# EasyEDA Pro project RinaBoard_V1_0.eprj, board PCB1
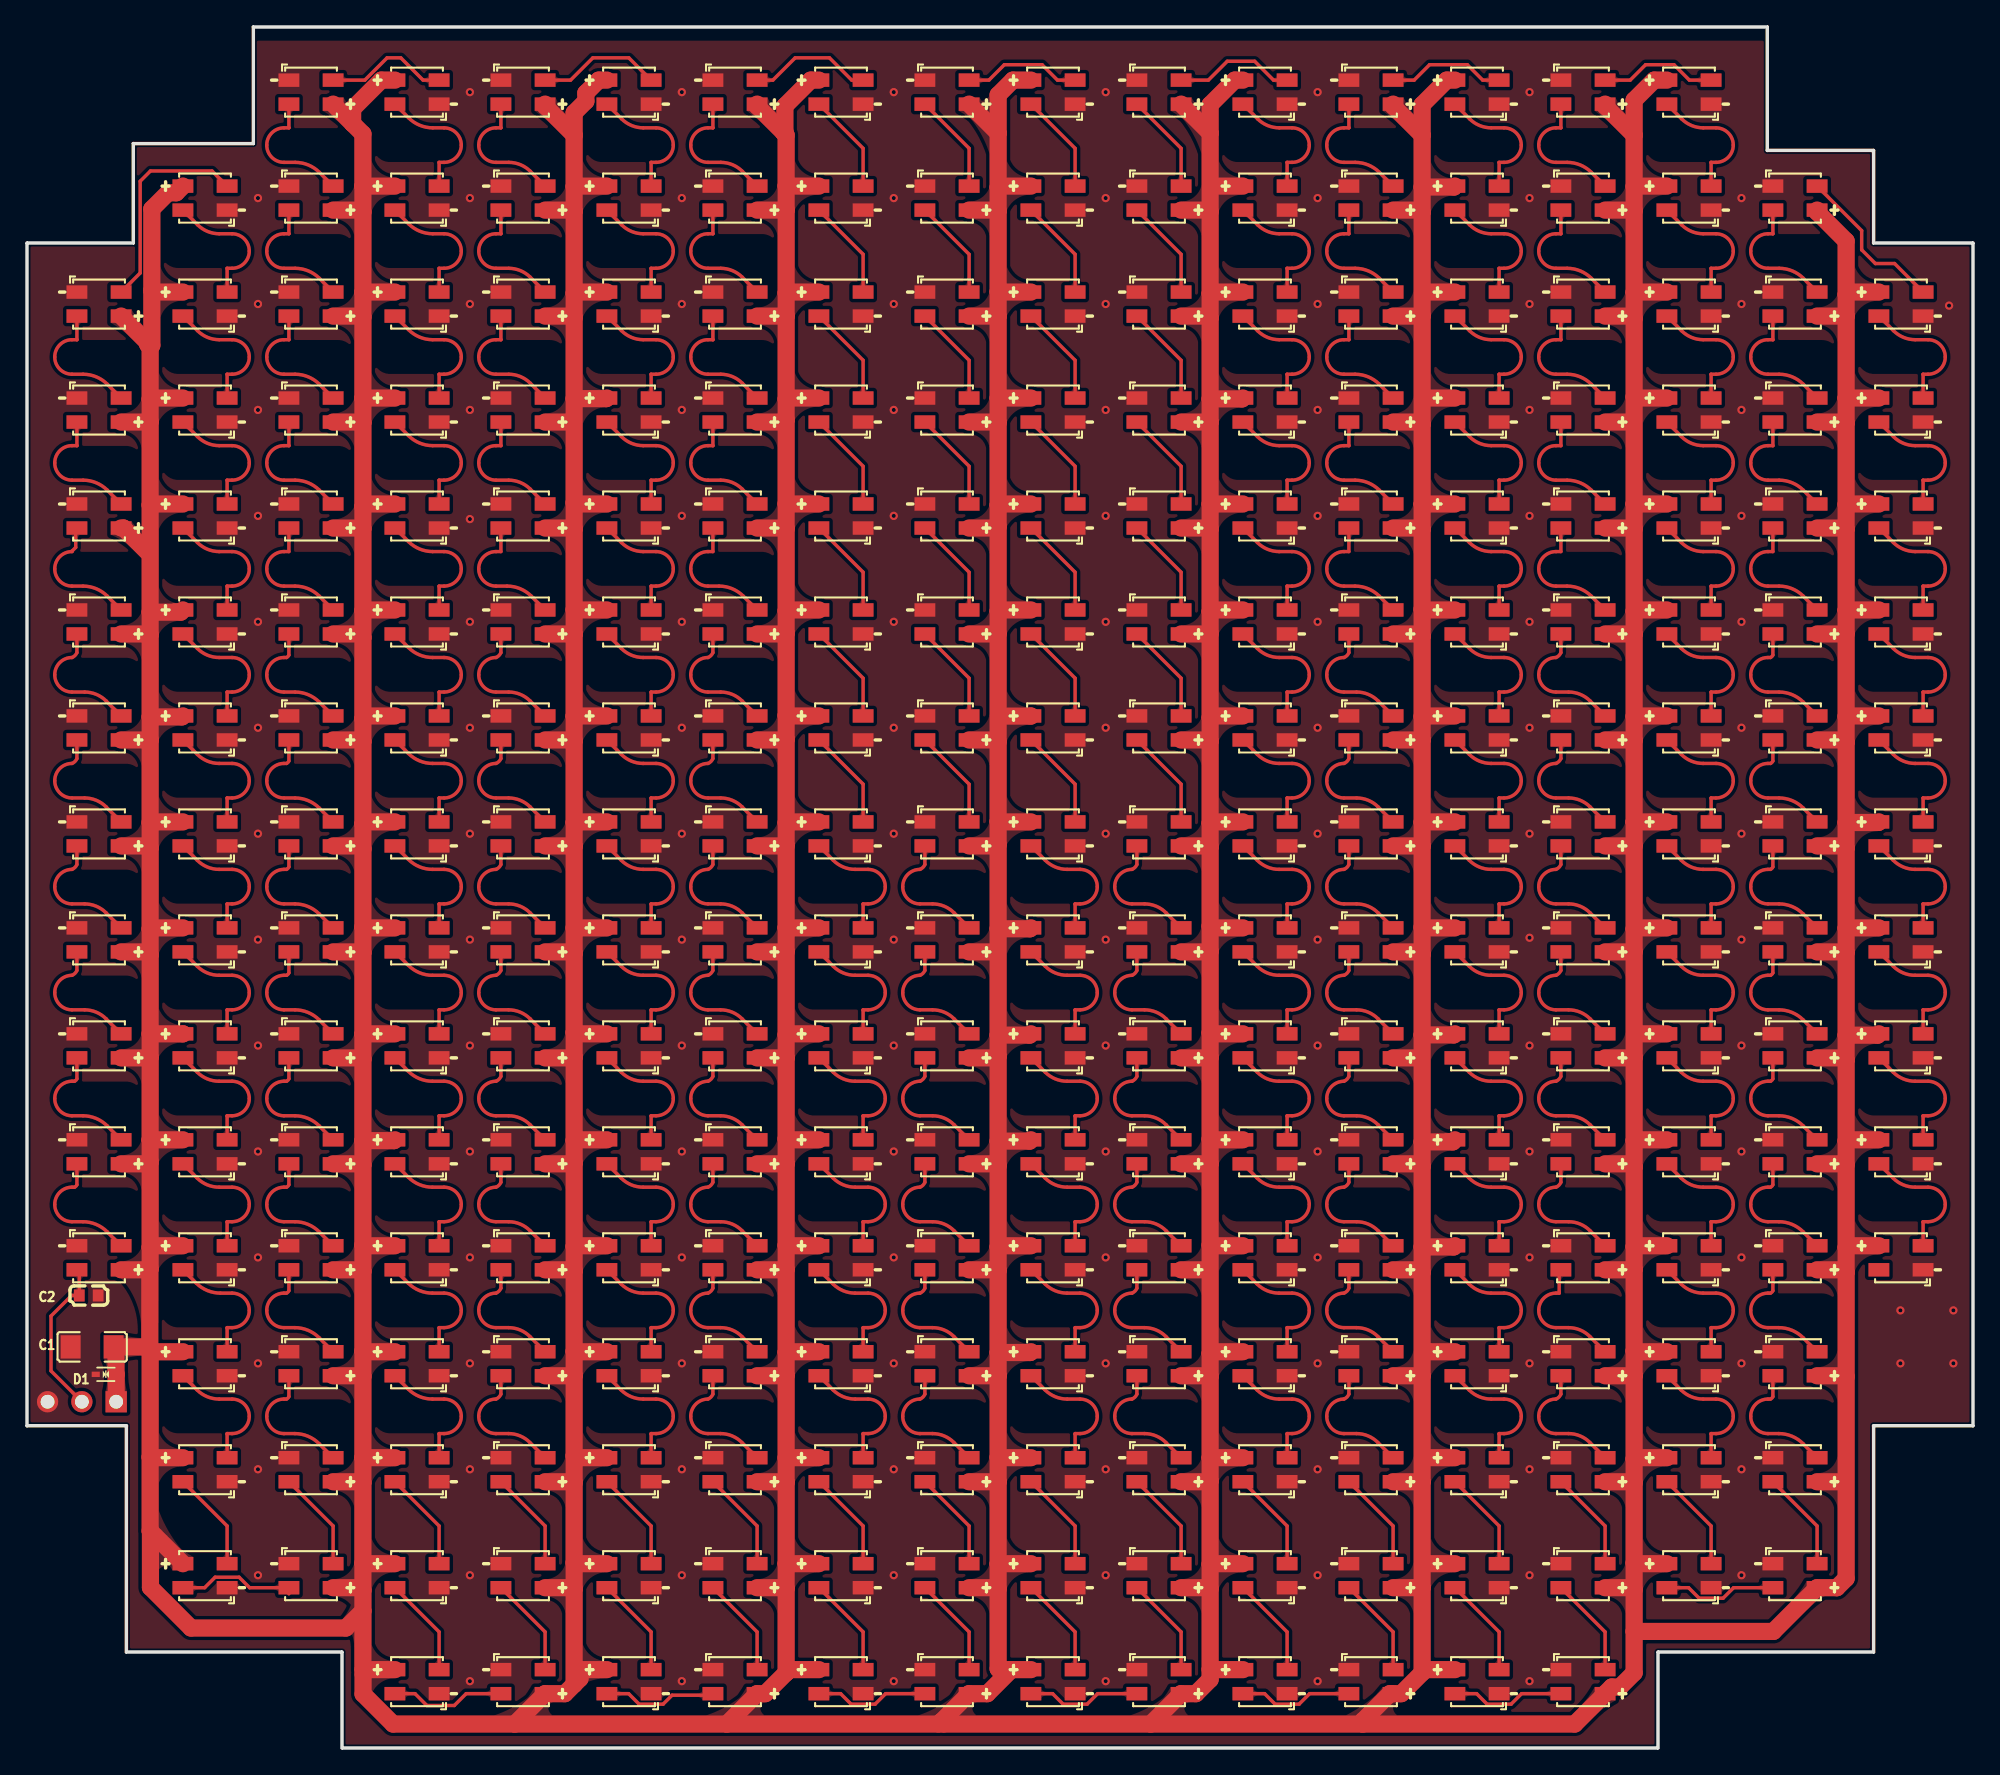
[diagram p5: board, top side]
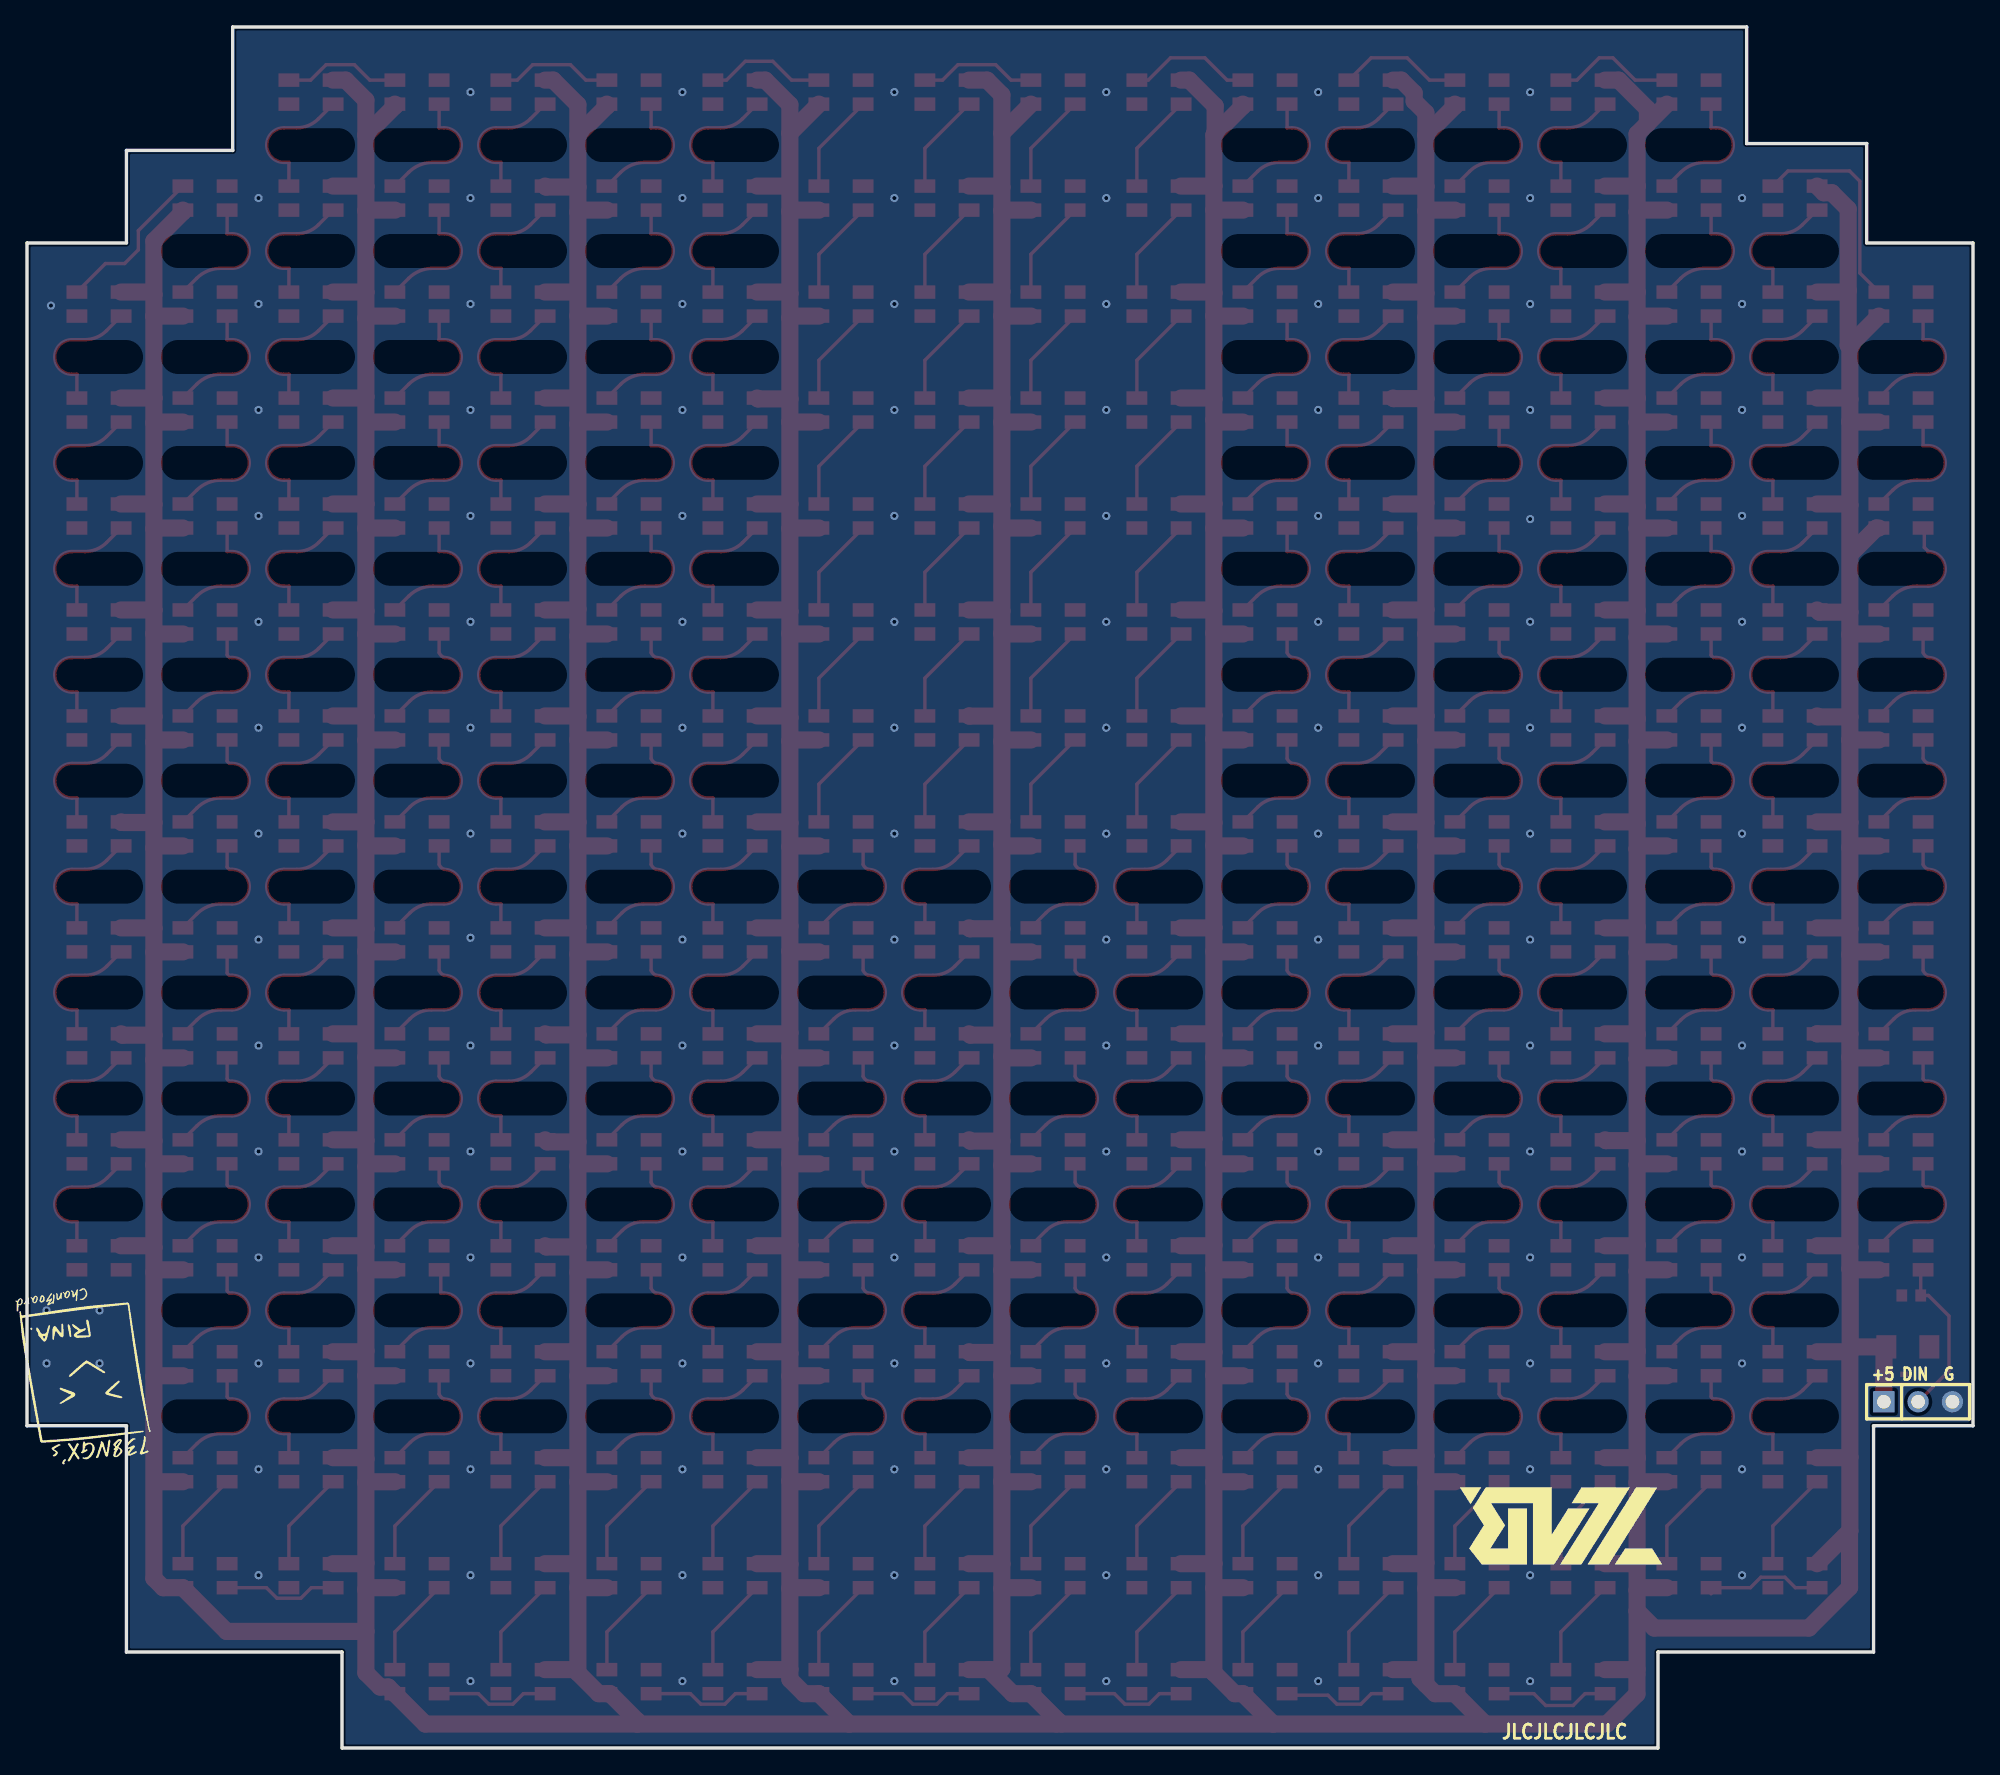
[diagram p6: board, bottom side, seen from below]

Outline 144.14 x 127.51 mm; copper layers: Top Layer, Bottom Layer. Coordinates in mm from the lower left corner of the outline.
Outline path: 0,111.51 0,23.88 7.37,23.88 7.37,7.11 23.33,7.11 23.33,0 120.8,0 120.8,7.11 136.77,7.11 136.77,23.88 144.14,23.88 144.14,111.51 136.77,111.51 136.77,118.36 128.9,118.36 128.9,127.51 16.76,127.51 16.76,118.87 7.87,118.87 7.87,111.51 0,111.51
Stack: Top Layer 0.035mm / Dielectric1 1.51mm FR4 er 4.5 / Bottom Layer 0.035mm

## Design rules (mm)
template: 自定义配置
spacing copperThickness1oz (default): track to track 0.102, other pairs 0.152 to 0.3
spacing copperThickness2oz: track to track 0.203, other pairs 0.152 to 0.3
track width copperThickness1oz (default): min 0.127, default 0.254, max 2.54
track width copperThickness2oz: min 0.203, default 0.254, max 2.54
differential pair differentialPair (default): width min 0.127, default 0.254, max 2.54; gap min 0.152, default 0.152
via viaSize (default): diameter min 0.5, default 0.61, max 10; hole min 0.3, default 0.305, max 6.3
pour e16117 uses copperRegion

## Placement (name value [footprint] x y rotation side)
C1  47uF  [C1206]  4.83 29.72 0 top
C2  100nF  [C0603]  4.57 33.53 180 top
D1  ESD5B5.0ST1G-N  [SOD-523_L1.2-W0.8-LS1.6-BI]  5.84 27.69 180 top
H1  -  [HDR-TH_3P-P2.54-V-F]  4.06 25.65 180 bottom
LED0  WS2812B-MINI-V3/W  [LED-SMD_4P-L3.5-W3.5-TL_WS2812B]  5.33 36.32 180 top
LED1  WS2812B-MINI-V3/W  [LED-SMD_4P-L3.5-W3.5-TL_WS2812B]  5.33 44.17 180 top
LED2  WS2812B-MINI-V3/W  [LED-SMD_4P-L3.5-W3.5-TL_WS2812B]  5.33 52.02 180 top
LED3  WS2812B-MINI-V3/W  [LED-SMD_4P-L3.5-W3.5-TL_WS2812B]  5.33 59.87 180 top
LED4  WS2812B-MINI-V3/W  [LED-SMD_4P-L3.5-W3.5-TL_WS2812B]  5.33 67.72 180 top
LED5  WS2812B-MINI-V3/W  [LED-SMD_4P-L3.5-W3.5-TL_WS2812B]  5.33 75.57 180 top
LED6  WS2812B-MINI-V3/W  [LED-SMD_4P-L3.5-W3.5-TL_WS2812B]  5.33 83.43 180 top
LED7  WS2812B-MINI-V3/W  [LED-SMD_4P-L3.5-W3.5-TL_WS2812B]  5.33 91.28 180 top
LED8  WS2812B-MINI-V3/W  [LED-SMD_4P-L3.5-W3.5-TL_WS2812B]  5.33 99.13 180 top
LED9  WS2812B-MINI-V3/W  [LED-SMD_4P-L3.5-W3.5-TL_WS2812B]  5.33 106.98 180 top
LED10  WS2812B-MINI-V3/W  [LED-SMD_4P-L3.5-W3.5-TL_WS2812B]  13.19 114.83 0 top
LED11  WS2812B-MINI-V3/W  [LED-SMD_4P-L3.5-W3.5-TL_WS2812B]  13.19 106.98 0 top
LED12  WS2812B-MINI-V3/W  [LED-SMD_4P-L3.5-W3.5-TL_WS2812B]  13.19 99.13 0 top
LED13  WS2812B-MINI-V3/W  [LED-SMD_4P-L3.5-W3.5-TL_WS2812B]  13.19 91.28 0 top
LED14  WS2812B-MINI-V3/W  [LED-SMD_4P-L3.5-W3.5-TL_WS2812B]  13.19 83.43 0 top
LED15  WS2812B-MINI-V3/W  [LED-SMD_4P-L3.5-W3.5-TL_WS2812B]  13.19 75.57 0 top
LED16  WS2812B-MINI-V3/W  [LED-SMD_4P-L3.5-W3.5-TL_WS2812B]  13.19 67.72 0 top
LED17  WS2812B-MINI-V3/W  [LED-SMD_4P-L3.5-W3.5-TL_WS2812B]  13.19 59.87 0 top
LED18  WS2812B-MINI-V3/W  [LED-SMD_4P-L3.5-W3.5-TL_WS2812B]  13.19 52.02 0 top
LED19  WS2812B-MINI-V3/W  [LED-SMD_4P-L3.5-W3.5-TL_WS2812B]  13.19 44.17 0 top
LED20  WS2812B-MINI-V3/W  [LED-SMD_4P-L3.5-W3.5-TL_WS2812B]  13.19 36.32 0 top
LED21  WS2812B-MINI-V3/W  [LED-SMD_4P-L3.5-W3.5-TL_WS2812B]  13.19 28.47 0 top
LED22  WS2812B-MINI-V3/W  [LED-SMD_4P-L3.5-W3.5-TL_WS2812B]  13.19 20.62 0 top
LED23  WS2812B-MINI-V3/W  [LED-SMD_4P-L3.5-W3.5-TL_WS2812B]  13.19 12.77 0 top
LED24  WS2812B-MINI-V3/W  [LED-SMD_4P-L3.5-W3.5-TL_WS2812B]  21.04 12.77 180 top
LED25  WS2812B-MINI-V3/W  [LED-SMD_4P-L3.5-W3.5-TL_WS2812B]  21.04 20.62 180 top
LED26  WS2812B-MINI-V3/W  [LED-SMD_4P-L3.5-W3.5-TL_WS2812B]  21.04 28.47 180 top
LED27  WS2812B-MINI-V3/W  [LED-SMD_4P-L3.5-W3.5-TL_WS2812B]  21.04 36.32 180 top
LED28  WS2812B-MINI-V3/W  [LED-SMD_4P-L3.5-W3.5-TL_WS2812B]  21.04 44.17 180 top
LED29  WS2812B-MINI-V3/W  [LED-SMD_4P-L3.5-W3.5-TL_WS2812B]  21.04 52.02 180 top
LED30  WS2812B-MINI-V3/W  [LED-SMD_4P-L3.5-W3.5-TL_WS2812B]  21.04 59.87 180 top
LED31  WS2812B-MINI-V3/W  [LED-SMD_4P-L3.5-W3.5-TL_WS2812B]  21.04 67.72 180 top
LED32  WS2812B-MINI-V3/W  [LED-SMD_4P-L3.5-W3.5-TL_WS2812B]  21.04 75.57 180 top
LED33  WS2812B-MINI-V3/W  [LED-SMD_4P-L3.5-W3.5-TL_WS2812B]  21.04 83.43 180 top
LED34  WS2812B-MINI-V3/W  [LED-SMD_4P-L3.5-W3.5-TL_WS2812B]  21.04 91.28 180 top
LED35  WS2812B-MINI-V3/W  [LED-SMD_4P-L3.5-W3.5-TL_WS2812B]  21.04 99.13 180 top
LED36  WS2812B-MINI-V3/W  [LED-SMD_4P-L3.5-W3.5-TL_WS2812B]  21.04 106.98 180 top
LED37  WS2812B-MINI-V3/W  [LED-SMD_4P-L3.5-W3.5-TL_WS2812B]  21.04 114.83 180 top
LED38  WS2812B-MINI-V3/W  [LED-SMD_4P-L3.5-W3.5-TL_WS2812B]  21.04 122.68 180 top
LED39  WS2812B-MINI-V3/W  [LED-SMD_4P-L3.5-W3.5-TL_WS2812B]  28.89 122.68 0 top
LED40  WS2812B-MINI-V3/W  [LED-SMD_4P-L3.5-W3.5-TL_WS2812B]  28.89 114.83 0 top
LED41  WS2812B-MINI-V3/W  [LED-SMD_4P-L3.5-W3.5-TL_WS2812B]  28.89 106.98 0 top
LED42  WS2812B-MINI-V3/W  [LED-SMD_4P-L3.5-W3.5-TL_WS2812B]  28.89 99.13 0 top
LED43  WS2812B-MINI-V3/W  [LED-SMD_4P-L3.5-W3.5-TL_WS2812B]  28.89 91.28 0 top
LED44  WS2812B-MINI-V3/W  [LED-SMD_4P-L3.5-W3.5-TL_WS2812B]  28.89 83.43 0 top
LED45  WS2812B-MINI-V3/W  [LED-SMD_4P-L3.5-W3.5-TL_WS2812B]  28.89 75.57 0 top
LED46  WS2812B-MINI-V3/W  [LED-SMD_4P-L3.5-W3.5-TL_WS2812B]  28.89 67.72 0 top
LED47  WS2812B-MINI-V3/W  [LED-SMD_4P-L3.5-W3.5-TL_WS2812B]  28.89 59.87 0 top
LED48  WS2812B-MINI-V3/W  [LED-SMD_4P-L3.5-W3.5-TL_WS2812B]  28.89 52.02 0 top
LED49  WS2812B-MINI-V3/W  [LED-SMD_4P-L3.5-W3.5-TL_WS2812B]  28.89 44.17 0 top
LED50  WS2812B-MINI-V3/W  [LED-SMD_4P-L3.5-W3.5-TL_WS2812B]  28.89 36.32 0 top
LED51  WS2812B-MINI-V3/W  [LED-SMD_4P-L3.5-W3.5-TL_WS2812B]  28.89 28.47 0 top
LED52  WS2812B-MINI-V3/W  [LED-SMD_4P-L3.5-W3.5-TL_WS2812B]  28.89 20.62 0 top
LED53  WS2812B-MINI-V3/W  [LED-SMD_4P-L3.5-W3.5-TL_WS2812B]  28.89 12.77 0 top
LED54  WS2812B-MINI-V3/W  [LED-SMD_4P-L3.5-W3.5-TL_WS2812B]  28.89 4.91 0 top
LED55  WS2812B-MINI-V3/W  [LED-SMD_4P-L3.5-W3.5-TL_WS2812B]  36.74 4.91 180 top
LED56  WS2812B-MINI-V3/W  [LED-SMD_4P-L3.5-W3.5-TL_WS2812B]  36.74 12.77 180 top
LED57  WS2812B-MINI-V3/W  [LED-SMD_4P-L3.5-W3.5-TL_WS2812B]  36.74 20.62 180 top
LED58  WS2812B-MINI-V3/W  [LED-SMD_4P-L3.5-W3.5-TL_WS2812B]  36.74 28.47 180 top
LED59  WS2812B-MINI-V3/W  [LED-SMD_4P-L3.5-W3.5-TL_WS2812B]  36.74 36.32 180 top
LED60  WS2812B-MINI-V3/W  [LED-SMD_4P-L3.5-W3.5-TL_WS2812B]  36.74 44.17 180 top
LED61  WS2812B-MINI-V3/W  [LED-SMD_4P-L3.5-W3.5-TL_WS2812B]  36.74 52.02 180 top
LED62  WS2812B-MINI-V3/W  [LED-SMD_4P-L3.5-W3.5-TL_WS2812B]  36.74 59.87 180 top
LED63  WS2812B-MINI-V3/W  [LED-SMD_4P-L3.5-W3.5-TL_WS2812B]  36.74 67.72 180 top
LED64  WS2812B-MINI-V3/W  [LED-SMD_4P-L3.5-W3.5-TL_WS2812B]  36.74 75.57 180 top
LED65  WS2812B-MINI-V3/W  [LED-SMD_4P-L3.5-W3.5-TL_WS2812B]  36.74 83.43 180 top
LED66  WS2812B-MINI-V3/W  [LED-SMD_4P-L3.5-W3.5-TL_WS2812B]  36.74 91.28 180 top
LED67  WS2812B-MINI-V3/W  [LED-SMD_4P-L3.5-W3.5-TL_WS2812B]  36.74 99.13 180 top
LED68  WS2812B-MINI-V3/W  [LED-SMD_4P-L3.5-W3.5-TL_WS2812B]  36.74 106.98 180 top
LED69  WS2812B-MINI-V3/W  [LED-SMD_4P-L3.5-W3.5-TL_WS2812B]  36.74 114.83 180 top
LED70  WS2812B-MINI-V3/W  [LED-SMD_4P-L3.5-W3.5-TL_WS2812B]  36.74 122.68 180 top
LED71  WS2812B-MINI-V3/W  [LED-SMD_4P-L3.5-W3.5-TL_WS2812B]  44.59 122.68 0 top
LED72  WS2812B-MINI-V3/W  [LED-SMD_4P-L3.5-W3.5-TL_WS2812B]  44.59 114.83 0 top
LED73  WS2812B-MINI-V3/W  [LED-SMD_4P-L3.5-W3.5-TL_WS2812B]  44.59 106.98 0 top
LED74  WS2812B-MINI-V3/W  [LED-SMD_4P-L3.5-W3.5-TL_WS2812B]  44.59 99.13 0 top
LED75  WS2812B-MINI-V3/W  [LED-SMD_4P-L3.5-W3.5-TL_WS2812B]  44.59 91.28 0 top
LED76  WS2812B-MINI-V3/W  [LED-SMD_4P-L3.5-W3.5-TL_WS2812B]  44.59 83.43 0 top
LED77  WS2812B-MINI-V3/W  [LED-SMD_4P-L3.5-W3.5-TL_WS2812B]  44.59 75.57 0 top
LED78  WS2812B-MINI-V3/W  [LED-SMD_4P-L3.5-W3.5-TL_WS2812B]  44.59 67.72 0 top
LED79  WS2812B-MINI-V3/W  [LED-SMD_4P-L3.5-W3.5-TL_WS2812B]  44.59 59.87 0 top
LED80  WS2812B-MINI-V3/W  [LED-SMD_4P-L3.5-W3.5-TL_WS2812B]  44.59 52.02 0 top
LED81  WS2812B-MINI-V3/W  [LED-SMD_4P-L3.5-W3.5-TL_WS2812B]  44.59 44.17 0 top
LED82  WS2812B-MINI-V3/W  [LED-SMD_4P-L3.5-W3.5-TL_WS2812B]  44.59 36.32 0 top
LED83  WS2812B-MINI-V3/W  [LED-SMD_4P-L3.5-W3.5-TL_WS2812B]  44.59 28.47 0 top
LED84  WS2812B-MINI-V3/W  [LED-SMD_4P-L3.5-W3.5-TL_WS2812B]  44.59 20.62 0 top
LED85  WS2812B-MINI-V3/W  [LED-SMD_4P-L3.5-W3.5-TL_WS2812B]  44.59 12.77 0 top
LED86  WS2812B-MINI-V3/W  [LED-SMD_4P-L3.5-W3.5-TL_WS2812B]  44.59 4.91 0 top
LED87  WS2812B-MINI-V3/W  [LED-SMD_4P-L3.5-W3.5-TL_WS2812B]  52.44 4.91 180 top
LED88  WS2812B-MINI-V3/W  [LED-SMD_4P-L3.5-W3.5-TL_WS2812B]  52.44 12.77 180 top
LED89  WS2812B-MINI-V3/W  [LED-SMD_4P-L3.5-W3.5-TL_WS2812B]  52.44 20.62 180 top
LED90  WS2812B-MINI-V3/W  [LED-SMD_4P-L3.5-W3.5-TL_WS2812B]  52.44 28.47 180 top
LED91  WS2812B-MINI-V3/W  [LED-SMD_4P-L3.5-W3.5-TL_WS2812B]  52.44 36.32 180 top
LED92  WS2812B-MINI-V3/W  [LED-SMD_4P-L3.5-W3.5-TL_WS2812B]  52.44 44.17 180 top
LED93  WS2812B-MINI-V3/W  [LED-SMD_4P-L3.5-W3.5-TL_WS2812B]  52.44 52.02 180 top
LED94  WS2812B-MINI-V3/W  [LED-SMD_4P-L3.5-W3.5-TL_WS2812B]  52.44 59.87 180 top
LED95  WS2812B-MINI-V3/W  [LED-SMD_4P-L3.5-W3.5-TL_WS2812B]  52.44 67.72 180 top
LED96  WS2812B-MINI-V3/W  [LED-SMD_4P-L3.5-W3.5-TL_WS2812B]  52.44 75.57 180 top
LED97  WS2812B-MINI-V3/W  [LED-SMD_4P-L3.5-W3.5-TL_WS2812B]  52.44 83.43 180 top
LED98  WS2812B-MINI-V3/W  [LED-SMD_4P-L3.5-W3.5-TL_WS2812B]  52.44 91.28 180 top
LED99  WS2812B-MINI-V3/W  [LED-SMD_4P-L3.5-W3.5-TL_WS2812B]  52.44 99.13 180 top
LED100  WS2812B-MINI-V3/W  [LED-SMD_4P-L3.5-W3.5-TL_WS2812B]  52.44 106.98 180 top
LED101  WS2812B-MINI-V3/W  [LED-SMD_4P-L3.5-W3.5-TL_WS2812B]  52.44 114.83 180 top
LED102  WS2812B-MINI-V3/W  [LED-SMD_4P-L3.5-W3.5-TL_WS2812B]  52.44 122.68 180 top
LED103  WS2812B-MINI-V3/W  [LED-SMD_4P-L3.5-W3.5-TL_WS2812B]  60.29 122.68 0 top
LED104  WS2812B-MINI-V3/W  [LED-SMD_4P-L3.5-W3.5-TL_WS2812B]  60.29 114.83 0 top
LED105  WS2812B-MINI-V3/W  [LED-SMD_4P-L3.5-W3.5-TL_WS2812B]  60.29 106.98 0 top
LED106  WS2812B-MINI-V3/W  [LED-SMD_4P-L3.5-W3.5-TL_WS2812B]  60.29 99.13 0 top
LED107  WS2812B-MINI-V3/W  [LED-SMD_4P-L3.5-W3.5-TL_WS2812B]  60.29 91.28 0 top
LED108  WS2812B-MINI-V3/W  [LED-SMD_4P-L3.5-W3.5-TL_WS2812B]  60.29 83.43 0 top
LED109  WS2812B-MINI-V3/W  [LED-SMD_4P-L3.5-W3.5-TL_WS2812B]  60.29 75.57 0 top
LED110  WS2812B-MINI-V3/W  [LED-SMD_4P-L3.5-W3.5-TL_WS2812B]  60.29 67.72 0 top
LED111  WS2812B-MINI-V3/W  [LED-SMD_4P-L3.5-W3.5-TL_WS2812B]  60.29 59.87 0 top
LED112  WS2812B-MINI-V3/W  [LED-SMD_4P-L3.5-W3.5-TL_WS2812B]  60.29 52.02 0 top
LED113  WS2812B-MINI-V3/W  [LED-SMD_4P-L3.5-W3.5-TL_WS2812B]  60.29 44.17 0 top
LED114  WS2812B-MINI-V3/W  [LED-SMD_4P-L3.5-W3.5-TL_WS2812B]  60.29 36.32 0 top
LED115  WS2812B-MINI-V3/W  [LED-SMD_4P-L3.5-W3.5-TL_WS2812B]  60.29 28.47 0 top
LED116  WS2812B-MINI-V3/W  [LED-SMD_4P-L3.5-W3.5-TL_WS2812B]  60.29 20.62 0 top
LED117  WS2812B-MINI-V3/W  [LED-SMD_4P-L3.5-W3.5-TL_WS2812B]  60.29 12.77 0 top
LED118  WS2812B-MINI-V3/W  [LED-SMD_4P-L3.5-W3.5-TL_WS2812B]  60.29 4.91 0 top
LED119  WS2812B-MINI-V3/W  [LED-SMD_4P-L3.5-W3.5-TL_WS2812B]  68.14 4.91 180 top
LED120  WS2812B-MINI-V3/W  [LED-SMD_4P-L3.5-W3.5-TL_WS2812B]  68.14 12.77 180 top
LED121  WS2812B-MINI-V3/W  [LED-SMD_4P-L3.5-W3.5-TL_WS2812B]  68.14 20.62 180 top
LED122  WS2812B-MINI-V3/W  [LED-SMD_4P-L3.5-W3.5-TL_WS2812B]  68.14 28.47 180 top
LED123  WS2812B-MINI-V3/W  [LED-SMD_4P-L3.5-W3.5-TL_WS2812B]  68.14 36.32 180 top
LED124  WS2812B-MINI-V3/W  [LED-SMD_4P-L3.5-W3.5-TL_WS2812B]  68.14 44.17 180 top
LED125  WS2812B-MINI-V3/W  [LED-SMD_4P-L3.5-W3.5-TL_WS2812B]  68.14 52.02 180 top
LED126  WS2812B-MINI-V3/W  [LED-SMD_4P-L3.5-W3.5-TL_WS2812B]  68.14 59.87 180 top
LED127  WS2812B-MINI-V3/W  [LED-SMD_4P-L3.5-W3.5-TL_WS2812B]  68.14 67.72 180 top
LED128  WS2812B-MINI-V3/W  [LED-SMD_4P-L3.5-W3.5-TL_WS2812B]  68.14 75.57 180 top
LED129  WS2812B-MINI-V3/W  [LED-SMD_4P-L3.5-W3.5-TL_WS2812B]  68.14 83.43 180 top
LED130  WS2812B-MINI-V3/W  [LED-SMD_4P-L3.5-W3.5-TL_WS2812B]  68.14 91.28 180 top
LED131  WS2812B-MINI-V3/W  [LED-SMD_4P-L3.5-W3.5-TL_WS2812B]  68.14 99.13 180 top
LED132  WS2812B-MINI-V3/W  [LED-SMD_4P-L3.5-W3.5-TL_WS2812B]  68.14 106.98 180 top
LED133  WS2812B-MINI-V3/W  [LED-SMD_4P-L3.5-W3.5-TL_WS2812B]  68.14 114.83 180 top
LED134  WS2812B-MINI-V3/W  [LED-SMD_4P-L3.5-W3.5-TL_WS2812B]  68.14 122.68 180 top
LED135  WS2812B-MINI-V3/W  [LED-SMD_4P-L3.5-W3.5-TL_WS2812B]  75.99 122.68 0 top
LED136  WS2812B-MINI-V3/W  [LED-SMD_4P-L3.5-W3.5-TL_WS2812B]  75.99 114.83 0 top
LED137  WS2812B-MINI-V3/W  [LED-SMD_4P-L3.5-W3.5-TL_WS2812B]  75.99 106.98 0 top
LED138  WS2812B-MINI-V3/W  [LED-SMD_4P-L3.5-W3.5-TL_WS2812B]  75.99 99.13 0 top
LED139  WS2812B-MINI-V3/W  [LED-SMD_4P-L3.5-W3.5-TL_WS2812B]  75.99 91.28 0 top
LED140  WS2812B-MINI-V3/W  [LED-SMD_4P-L3.5-W3.5-TL_WS2812B]  75.99 83.43 0 top
LED141  WS2812B-MINI-V3/W  [LED-SMD_4P-L3.5-W3.5-TL_WS2812B]  75.99 75.57 0 top
LED142  WS2812B-MINI-V3/W  [LED-SMD_4P-L3.5-W3.5-TL_WS2812B]  75.99 67.72 0 top
LED143  WS2812B-MINI-V3/W  [LED-SMD_4P-L3.5-W3.5-TL_WS2812B]  75.99 59.87 0 top
LED144  WS2812B-MINI-V3/W  [LED-SMD_4P-L3.5-W3.5-TL_WS2812B]  75.99 52.02 0 top
LED145  WS2812B-MINI-V3/W  [LED-SMD_4P-L3.5-W3.5-TL_WS2812B]  75.99 44.17 0 top
LED146  WS2812B-MINI-V3/W  [LED-SMD_4P-L3.5-W3.5-TL_WS2812B]  75.99 36.32 0 top
LED147  WS2812B-MINI-V3/W  [LED-SMD_4P-L3.5-W3.5-TL_WS2812B]  75.99 28.47 0 top
LED148  WS2812B-MINI-V3/W  [LED-SMD_4P-L3.5-W3.5-TL_WS2812B]  75.99 20.62 0 top
LED149  WS2812B-MINI-V3/W  [LED-SMD_4P-L3.5-W3.5-TL_WS2812B]  75.99 12.77 0 top
LED150  WS2812B-MINI-V3/W  [LED-SMD_4P-L3.5-W3.5-TL_WS2812B]  75.99 4.91 0 top
LED151  WS2812B-MINI-V3/W  [LED-SMD_4P-L3.5-W3.5-TL_WS2812B]  83.85 4.91 180 top
LED152  WS2812B-MINI-V3/W  [LED-SMD_4P-L3.5-W3.5-TL_WS2812B]  83.85 12.77 180 top
LED153  WS2812B-MINI-V3/W  [LED-SMD_4P-L3.5-W3.5-TL_WS2812B]  83.85 20.62 180 top
LED154  WS2812B-MINI-V3/W  [LED-SMD_4P-L3.5-W3.5-TL_WS2812B]  83.85 28.47 180 top
LED155  WS2812B-MINI-V3/W  [LED-SMD_4P-L3.5-W3.5-TL_WS2812B]  83.85 36.32 180 top
LED156  WS2812B-MINI-V3/W  [LED-SMD_4P-L3.5-W3.5-TL_WS2812B]  83.85 44.17 180 top
LED157  WS2812B-MINI-V3/W  [LED-SMD_4P-L3.5-W3.5-TL_WS2812B]  83.85 52.02 180 top
LED158  WS2812B-MINI-V3/W  [LED-SMD_4P-L3.5-W3.5-TL_WS2812B]  83.85 59.87 180 top
LED159  WS2812B-MINI-V3/W  [LED-SMD_4P-L3.5-W3.5-TL_WS2812B]  83.85 67.72 180 top
LED160  WS2812B-MINI-V3/W  [LED-SMD_4P-L3.5-W3.5-TL_WS2812B]  83.85 75.57 180 top
LED161  WS2812B-MINI-V3/W  [LED-SMD_4P-L3.5-W3.5-TL_WS2812B]  83.85 83.43 180 top
LED162  WS2812B-MINI-V3/W  [LED-SMD_4P-L3.5-W3.5-TL_WS2812B]  83.85 91.28 180 top
LED163  WS2812B-MINI-V3/W  [LED-SMD_4P-L3.5-W3.5-TL_WS2812B]  83.85 99.13 180 top
LED164  WS2812B-MINI-V3/W  [LED-SMD_4P-L3.5-W3.5-TL_WS2812B]  83.85 106.98 180 top
LED165  WS2812B-MINI-V3/W  [LED-SMD_4P-L3.5-W3.5-TL_WS2812B]  83.85 114.83 180 top
LED166  WS2812B-MINI-V3/W  [LED-SMD_4P-L3.5-W3.5-TL_WS2812B]  83.85 122.68 180 top
LED167  WS2812B-MINI-V3/W  [LED-SMD_4P-L3.5-W3.5-TL_WS2812B]  91.7 122.68 0 top
LED168  WS2812B-MINI-V3/W  [LED-SMD_4P-L3.5-W3.5-TL_WS2812B]  91.7 114.83 0 top
LED169  WS2812B-MINI-V3/W  [LED-SMD_4P-L3.5-W3.5-TL_WS2812B]  91.7 106.98 0 top
LED170  WS2812B-MINI-V3/W  [LED-SMD_4P-L3.5-W3.5-TL_WS2812B]  91.7 99.13 0 top
LED171  WS2812B-MINI-V3/W  [LED-SMD_4P-L3.5-W3.5-TL_WS2812B]  91.7 91.28 0 top
LED172  WS2812B-MINI-V3/W  [LED-SMD_4P-L3.5-W3.5-TL_WS2812B]  91.7 83.43 0 top
LED173  WS2812B-MINI-V3/W  [LED-SMD_4P-L3.5-W3.5-TL_WS2812B]  91.7 75.57 0 top
LED174  WS2812B-MINI-V3/W  [LED-SMD_4P-L3.5-W3.5-TL_WS2812B]  91.7 67.72 0 top
LED175  WS2812B-MINI-V3/W  [LED-SMD_4P-L3.5-W3.5-TL_WS2812B]  91.7 59.87 0 top
LED176  WS2812B-MINI-V3/W  [LED-SMD_4P-L3.5-W3.5-TL_WS2812B]  91.7 52.02 0 top
LED177  WS2812B-MINI-V3/W  [LED-SMD_4P-L3.5-W3.5-TL_WS2812B]  91.7 44.17 0 top
LED178  WS2812B-MINI-V3/W  [LED-SMD_4P-L3.5-W3.5-TL_WS2812B]  91.7 36.32 0 top
LED179  WS2812B-MINI-V3/W  [LED-SMD_4P-L3.5-W3.5-TL_WS2812B]  91.7 28.47 0 top
LED180  WS2812B-MINI-V3/W  [LED-SMD_4P-L3.5-W3.5-TL_WS2812B]  91.7 20.62 0 top
LED181  WS2812B-MINI-V3/W  [LED-SMD_4P-L3.5-W3.5-TL_WS2812B]  91.7 12.77 0 top
LED182  WS2812B-MINI-V3/W  [LED-SMD_4P-L3.5-W3.5-TL_WS2812B]  91.7 4.91 0 top
LED183  WS2812B-MINI-V3/W  [LED-SMD_4P-L3.5-W3.5-TL_WS2812B]  99.55 4.91 180 top
LED184  WS2812B-MINI-V3/W  [LED-SMD_4P-L3.5-W3.5-TL_WS2812B]  99.55 12.77 180 top
LED185  WS2812B-MINI-V3/W  [LED-SMD_4P-L3.5-W3.5-TL_WS2812B]  99.55 20.62 180 top
LED186  WS2812B-MINI-V3/W  [LED-SMD_4P-L3.5-W3.5-TL_WS2812B]  99.55 28.47 180 top
LED187  WS2812B-MINI-V3/W  [LED-SMD_4P-L3.5-W3.5-TL_WS2812B]  99.55 36.32 180 top
LED188  WS2812B-MINI-V3/W  [LED-SMD_4P-L3.5-W3.5-TL_WS2812B]  99.55 44.17 180 top
LED189  WS2812B-MINI-V3/W  [LED-SMD_4P-L3.5-W3.5-TL_WS2812B]  99.55 52.02 180 top
LED190  WS2812B-MINI-V3/W  [LED-SMD_4P-L3.5-W3.5-TL_WS2812B]  99.55 59.87 180 top
LED191  WS2812B-MINI-V3/W  [LED-SMD_4P-L3.5-W3.5-TL_WS2812B]  99.55 67.72 180 top
LED192  WS2812B-MINI-V3/W  [LED-SMD_4P-L3.5-W3.5-TL_WS2812B]  99.55 75.57 180 top
LED193  WS2812B-MINI-V3/W  [LED-SMD_4P-L3.5-W3.5-TL_WS2812B]  99.55 83.43 180 top
LED194  WS2812B-MINI-V3/W  [LED-SMD_4P-L3.5-W3.5-TL_WS2812B]  99.55 91.28 180 top
LED195  WS2812B-MINI-V3/W  [LED-SMD_4P-L3.5-W3.5-TL_WS2812B]  99.55 99.13 180 top
LED196  WS2812B-MINI-V3/W  [LED-SMD_4P-L3.5-W3.5-TL_WS2812B]  99.55 106.98 180 top
LED197  WS2812B-MINI-V3/W  [LED-SMD_4P-L3.5-W3.5-TL_WS2812B]  99.55 114.83 180 top
LED198  WS2812B-MINI-V3/W  [LED-SMD_4P-L3.5-W3.5-TL_WS2812B]  99.55 122.68 180 top
LED199  WS2812B-MINI-V3/W  [LED-SMD_4P-L3.5-W3.5-TL_WS2812B]  107.4 122.68 0 top
LED200  WS2812B-MINI-V3/W  [LED-SMD_4P-L3.5-W3.5-TL_WS2812B]  107.4 114.83 0 top
LED201  WS2812B-MINI-V3/W  [LED-SMD_4P-L3.5-W3.5-TL_WS2812B]  107.4 106.98 0 top
LED202  WS2812B-MINI-V3/W  [LED-SMD_4P-L3.5-W3.5-TL_WS2812B]  107.4 99.13 0 top
LED203  WS2812B-MINI-V3/W  [LED-SMD_4P-L3.5-W3.5-TL_WS2812B]  107.4 91.28 0 top
LED204  WS2812B-MINI-V3/W  [LED-SMD_4P-L3.5-W3.5-TL_WS2812B]  107.4 83.43 0 top
LED205  WS2812B-MINI-V3/W  [LED-SMD_4P-L3.5-W3.5-TL_WS2812B]  107.4 75.57 0 top
LED206  WS2812B-MINI-V3/W  [LED-SMD_4P-L3.5-W3.5-TL_WS2812B]  107.4 67.72 0 top
LED207  WS2812B-MINI-V3/W  [LED-SMD_4P-L3.5-W3.5-TL_WS2812B]  107.4 59.87 0 top
LED208  WS2812B-MINI-V3/W  [LED-SMD_4P-L3.5-W3.5-TL_WS2812B]  107.4 52.02 0 top
LED209  WS2812B-MINI-V3/W  [LED-SMD_4P-L3.5-W3.5-TL_WS2812B]  107.4 44.17 0 top
LED210  WS2812B-MINI-V3/W  [LED-SMD_4P-L3.5-W3.5-TL_WS2812B]  107.4 36.32 0 top
LED211  WS2812B-MINI-V3/W  [LED-SMD_4P-L3.5-W3.5-TL_WS2812B]  107.4 28.47 0 top
LED212  WS2812B-MINI-V3/W  [LED-SMD_4P-L3.5-W3.5-TL_WS2812B]  107.4 20.62 0 top
LED213  WS2812B-MINI-V3/W  [LED-SMD_4P-L3.5-W3.5-TL_WS2812B]  107.4 12.77 0 top
LED214  WS2812B-MINI-V3/W  [LED-SMD_4P-L3.5-W3.5-TL_WS2812B]  107.4 4.91 0 top
LED215  WS2812B-MINI-V3/W  [LED-SMD_4P-L3.5-W3.5-TL_WS2812B]  115.25 4.91 180 top
LED216  WS2812B-MINI-V3/W  [LED-SMD_4P-L3.5-W3.5-TL_WS2812B]  115.25 12.77 180 top
LED217  WS2812B-MINI-V3/W  [LED-SMD_4P-L3.5-W3.5-TL_WS2812B]  115.25 20.62 180 top
LED218  WS2812B-MINI-V3/W  [LED-SMD_4P-L3.5-W3.5-TL_WS2812B]  115.25 28.47 180 top
LED219  WS2812B-MINI-V3/W  [LED-SMD_4P-L3.5-W3.5-TL_WS2812B]  115.25 36.32 180 top
LED220  WS2812B-MINI-V3/W  [LED-SMD_4P-L3.5-W3.5-TL_WS2812B]  115.25 44.17 180 top
LED221  WS2812B-MINI-V3/W  [LED-SMD_4P-L3.5-W3.5-TL_WS2812B]  115.25 52.02 180 top
LED222  WS2812B-MINI-V3/W  [LED-SMD_4P-L3.5-W3.5-TL_WS2812B]  115.25 59.87 180 top
LED223  WS2812B-MINI-V3/W  [LED-SMD_4P-L3.5-W3.5-TL_WS2812B]  115.25 67.72 180 top
LED224  WS2812B-MINI-V3/W  [LED-SMD_4P-L3.5-W3.5-TL_WS2812B]  115.25 75.57 180 top
LED225  WS2812B-MINI-V3/W  [LED-SMD_4P-L3.5-W3.5-TL_WS2812B]  115.25 83.43 180 top
LED226  WS2812B-MINI-V3/W  [LED-SMD_4P-L3.5-W3.5-TL_WS2812B]  115.25 91.28 180 top
LED227  WS2812B-MINI-V3/W  [LED-SMD_4P-L3.5-W3.5-TL_WS2812B]  115.25 99.13 180 top
LED228  WS2812B-MINI-V3/W  [LED-SMD_4P-L3.5-W3.5-TL_WS2812B]  115.25 106.98 180 top
LED229  WS2812B-MINI-V3/W  [LED-SMD_4P-L3.5-W3.5-TL_WS2812B]  115.25 114.83 180 top
LED230  WS2812B-MINI-V3/W  [LED-SMD_4P-L3.5-W3.5-TL_WS2812B]  115.25 122.68 180 top
LED231  WS2812B-MINI-V3/W  [LED-SMD_4P-L3.5-W3.5-TL_WS2812B]  123.1 122.68 0 top
LED232  WS2812B-MINI-V3/W  [LED-SMD_4P-L3.5-W3.5-TL_WS2812B]  123.1 114.83 0 top
LED233  WS2812B-MINI-V3/W  [LED-SMD_4P-L3.5-W3.5-TL_WS2812B]  123.1 106.98 0 top
LED234  WS2812B-MINI-V3/W  [LED-SMD_4P-L3.5-W3.5-TL_WS2812B]  123.1 99.13 0 top
LED235  WS2812B-MINI-V3/W  [LED-SMD_4P-L3.5-W3.5-TL_WS2812B]  123.1 91.28 0 top
LED236  WS2812B-MINI-V3/W  [LED-SMD_4P-L3.5-W3.5-TL_WS2812B]  123.1 83.43 0 top
LED237  WS2812B-MINI-V3/W  [LED-SMD_4P-L3.5-W3.5-TL_WS2812B]  123.1 75.57 0 top
LED238  WS2812B-MINI-V3/W  [LED-SMD_4P-L3.5-W3.5-TL_WS2812B]  123.1 67.72 0 top
LED239  WS2812B-MINI-V3/W  [LED-SMD_4P-L3.5-W3.5-TL_WS2812B]  123.1 59.87 0 top
LED240  WS2812B-MINI-V3/W  [LED-SMD_4P-L3.5-W3.5-TL_WS2812B]  123.1 52.02 0 top
LED241  WS2812B-MINI-V3/W  [LED-SMD_4P-L3.5-W3.5-TL_WS2812B]  123.1 44.17 0 top
LED242  WS2812B-MINI-V3/W  [LED-SMD_4P-L3.5-W3.5-TL_WS2812B]  123.1 36.32 0 top
LED243  WS2812B-MINI-V3/W  [LED-SMD_4P-L3.5-W3.5-TL_WS2812B]  123.1 28.47 0 top
LED244  WS2812B-MINI-V3/W  [LED-SMD_4P-L3.5-W3.5-TL_WS2812B]  123.1 20.62 0 top
LED245  WS2812B-MINI-V3/W  [LED-SMD_4P-L3.5-W3.5-TL_WS2812B]  123.1 12.77 0 top
LED246  WS2812B-MINI-V3/W  [LED-SMD_4P-L3.5-W3.5-TL_WS2812B]  130.95 12.77 180 top
LED247  WS2812B-MINI-V3/W  [LED-SMD_4P-L3.5-W3.5-TL_WS2812B]  130.95 20.62 180 top
LED248  WS2812B-MINI-V3/W  [LED-SMD_4P-L3.5-W3.5-TL_WS2812B]  130.95 28.47 180 top
LED249  WS2812B-MINI-V3/W  [LED-SMD_4P-L3.5-W3.5-TL_WS2812B]  130.95 36.32 180 top
LED250  WS2812B-MINI-V3/W  [LED-SMD_4P-L3.5-W3.5-TL_WS2812B]  130.95 44.17 180 top
LED251  WS2812B-MINI-V3/W  [LED-SMD_4P-L3.5-W3.5-TL_WS2812B]  130.95 52.02 180 top
LED252  WS2812B-MINI-V3/W  [LED-SMD_4P-L3.5-W3.5-TL_WS2812B]  130.95 59.87 180 top
LED253  WS2812B-MINI-V3/W  [LED-SMD_4P-L3.5-W3.5-TL_WS2812B]  130.95 67.72 180 top
LED254  WS2812B-MINI-V3/W  [LED-SMD_4P-L3.5-W3.5-TL_WS2812B]  130.95 75.57 180 top
LED255  WS2812B-MINI-V3/W  [LED-SMD_4P-L3.5-W3.5-TL_WS2812B]  130.95 83.43 180 top
LED256  WS2812B-MINI-V3/W  [LED-SMD_4P-L3.5-W3.5-TL_WS2812B]  130.95 91.28 180 top
LED257  WS2812B-MINI-V3/W  [LED-SMD_4P-L3.5-W3.5-TL_WS2812B]  130.95 99.13 180 top
LED258  WS2812B-MINI-V3/W  [LED-SMD_4P-L3.5-W3.5-TL_WS2812B]  130.95 106.98 180 top
LED259  WS2812B-MINI-V3/W  [LED-SMD_4P-L3.5-W3.5-TL_WS2812B]  130.95 114.83 180 top
LED260  WS2812B-MINI-V3/W  [LED-SMD_4P-L3.5-W3.5-TL_WS2812B]  138.8 106.98 0 top
LED261  WS2812B-MINI-V3/W  [LED-SMD_4P-L3.5-W3.5-TL_WS2812B]  138.8 99.13 0 top
LED262  WS2812B-MINI-V3/W  [LED-SMD_4P-L3.5-W3.5-TL_WS2812B]  138.8 91.28 0 top
LED263  WS2812B-MINI-V3/W  [LED-SMD_4P-L3.5-W3.5-TL_WS2812B]  138.8 83.43 0 top
LED264  WS2812B-MINI-V3/W  [LED-SMD_4P-L3.5-W3.5-TL_WS2812B]  138.8 75.57 0 top
LED265  WS2812B-MINI-V3/W  [LED-SMD_4P-L3.5-W3.5-TL_WS2812B]  138.8 67.72 0 top
LED266  WS2812B-MINI-V3/W  [LED-SMD_4P-L3.5-W3.5-TL_WS2812B]  138.8 59.87 0 top
LED267  WS2812B-MINI-V3/W  [LED-SMD_4P-L3.5-W3.5-TL_WS2812B]  138.8 52.02 0 top
LED268  WS2812B-MINI-V3/W  [LED-SMD_4P-L3.5-W3.5-TL_WS2812B]  138.8 44.17 0 top
LED269  WS2812B-MINI-V3/W  [LED-SMD_4P-L3.5-W3.5-TL_WS2812B]  138.8 36.32 0 top

## Footprints (pads in the part's own frame, mm; a bottom-side part is the same pattern mirrored in y, then rotated)
C0603
  rect 0.8x0.9 smd: 1(-0.7,0) 2(0.7,0)
C1206
  rect 1.485x1.728 smd: 1(-1.593,0) 2(1.593,0)
HDR-TH_3P-P2.54-V-F
  rect 1.575x1.575 hole 1.02: 1(-2.54,0)
  round 1.575 hole 1.02: 2(0,0) 3(2.54,0)
LED-SMD_4P-L3.5-W3.5-TL_WS2812B
  rect 1.545x0.997 smd: 1(-1.637,0.89) 2(-1.637,-0.89) 3(1.637,-0.89) 4(1.637,0.89)
SOD-523_L1.2-W0.8-LS1.6-BI
  rect 0.6x0.4 smd: 1(-0.75,0) 2(0.75,0)

## Nets
As in the schematic.

Pads without a net: LED269 2

## Via types
v1: diameter 0.61, hole 0.305, Top Layer to Bottom Layer, 129 vias

## Routing (per net, layer and track width the routed paths; a pad name or vN(x,y) marks a point on that pad's centre or on a via; arc(x,y) is an arc through that point)
GND:
  vias: v1(17.11,114.83) v1(17.11,106.98) v1(17.11,99.14) v1(17.11,91.29) v1(17.11,83.44) v1(17.11,75.59) v1(17.11,67.74) v1(17.11,59.89) v1(17.11,52.04) v1(17.11,44.2) v1(17.11,36.35) v1(17.11,28.5) v1(17.11,20.65) v1(17.11,12.8) v1(32.8,122.68) v1(32.8,114.83) v1(32.8,106.98) v1(32.8,99.14) v1(32.8,91.05) v1(32.8,83.44) v1(32.8,75.59) v1(32.8,67.74) v1(32.8,59.89) v1(32.8,52.04) v1(32.8,44.2) v1(32.8,36.35) v1(32.8,28.5) v1(32.8,20.65) v1(32.8,12.8) v1(32.8,4.95) v1(48.5,122.68) v1(48.5,114.83) v1(48.5,106.98) v1(48.5,99.14) v1(48.5,91.29) v1(48.5,83.44) v1(48.5,75.59) v1(48.5,67.74) v1(48.5,59.89) v1(48.5,52.04) v1(48.5,44.2) v1(48.5,36.35) v1(48.5,28.5) v1(48.5,20.65) v1(48.5,12.8) v1(48.5,4.95) v1(64.2,122.68) v1(64.2,114.83) v1(64.2,106.98) v1(64.2,99.14) v1(64.2,91.29) v1(64.2,83.44) v1(64.2,75.59) v1(64.2,67.74) v1(64.2,59.89) v1(64.2,52.04) v1(64.2,44.2) v1(64.2,36.35) v1(64.2,28.5) v1(64.2,20.65) v1(64.2,12.8) v1(64.2,4.95) v1(79.9,122.68) v1(79.9,114.83) v1(79.9,106.98) v1(79.9,99.14) v1(79.9,91.29) v1(79.9,83.44) v1(79.9,75.59) v1(79.9,67.74) v1(79.9,59.89) v1(79.9,52.04) v1(79.9,44.2) v1(79.9,36.35) v1(79.9,28.5) v1(79.9,20.65) v1(79.9,12.8) v1(79.9,4.95) v1(95.59,122.68) v1(95.59,114.83) v1(95.59,106.98) v1(95.59,99.14) v1(95.59,91.29) v1(95.59,83.44) v1(95.59,75.59) v1(95.59,67.74) v1(95.59,59.89) v1(95.59,52.04) v1(95.59,44.2) v1(95.59,36.35) v1(95.59,28.5) v1(95.59,20.65) v1(95.59,12.8) v1(95.59,4.95) v1(111.29,122.68) v1(111.29,114.83) v1(111.29,106.98) v1(111.29,99.14) v1(111.29,91.29) v1(111.29,83.44) v1(111.29,75.59) v1(111.29,67.74) v1(111.29,60.03) v1(111.29,52.04) v1(111.29,44.2) v1(111.29,36.35) v1(111.29,28.5) v1(111.29,20.65) v1(111.29,12.8) v1(111.29,4.95) v1(126.99,114.83) v1(126.99,106.98) v1(126.99,99.14) v1(126.99,91.29) v1(126.99,83.44) v1(126.99,75.59) v1(126.99,67.74) v1(126.99,59.89) v1(126.99,52.04) v1(126.99,44.2) v1(126.99,36.35) v1(126.99,28.5) v1(126.99,20.65) v1(126.99,12.8) v1(138.76,32.42) v1(138.76,28.5) v1(142.36,106.87) v1(142.68,32.42) v1(142.68,28.5)
VCC: length 1808.3
  Top Layer w1.27: 87.63,105.95 87.63,107.76 ; 87.63,105.95 87.63,99.95 ; 87.63,105.95 87.5,106.09 LED164.1 ; 87.63,107.76 87.63,113.83 ; 87.63,107.76 87.74,107.87 90.06,107.87 ; 116.89,19.73 118.98,19.73 119.04,19.67 ; 87.63,21.5 87.64,21.51 90.06,21.51 ; 87.63,21.5 87.63,19.78 ; 87.63,21.5 87.63,27.54 ; 40.53,107.78 40.53,105.99 ; 40.53,107.78 40.61,107.87 LED73.1 ; 40.53,107.78 40.53,113.87 ; 40.53,105.99 40.53,99.97 ; 40.53,105.99 40.42,106.09 LED68.1 ; 9.12,45.06 9.12,45.06 LED19.1 ; 9.12,45.06 9.12,51.18 ; 9.12,45.06 9.12,43.42 ; 40.53,74.62 40.46,74.68 LED64.1 ; 40.53,74.62 40.53,76.46 ; 40.53,74.62 40.53,68.57 ; 40.53,113.87 40.46,113.94 LED69.1 ; 40.53,113.87 40.53,115.69 ; 134.74,52.81 134.74,58.95 ; 134.74,52.81 134.74,50.98 ; 134.74,52.81 137.07,52.81 LED267.1 ; 134.74,58.95 134.74,60.74 ; 134.74,58.95 134.71,58.98 LED252.1 ; 103.33,68.59 103.36,68.61 LED206.1 ; 103.33,68.59 103.33,66.83 ; 103.33,68.59 103.33,74.69 ; 101.19,19.73 103.32,19.73 103.33,19.72 ; 103.33,84.37 103.39,84.32 LED204.1 ; 103.33,84.37 103.33,82.37 ; 103.33,84.37 103.33,90.3 ; 103.33,119.5 103.33,121.75 105.16,123.57 LED199.1 ; 103.33,119.5 103.33,115.65 ; 103.33,119.5 101.19,121.65 LED198.1 ; 119.04,43.06 118.82,43.28 LED220.1 ; 119.04,43.06 119.04,45 ; 119.04,43.06 119.04,37.14 ; LED108.1 56.29,84.32 56.23,84.25 ; LED211.1 103.74,29.36 103.63,29.46 ; LED234.1 119.13,100.02 119.04,100.11 ; 9.12,84.15 11.39,84.15 LED14.1 ; 9.12,84.15 9.12,92.09 ; 9.12,84.15 9.12,82.49 ; 56.23,59.02 56.19,58.98 LED94.1 ; 56.23,59.02 56.23,60.78 ; 56.23,59.02 56.23,52.85 ; 71.93,82.57 71.9,82.54 LED129.1 ; 71.93,82.57 71.93,74.57 ; 71.93,82.57 71.93,84.24 ; 87.63,119.64 LED166.1 ; 87.63,119.64 87.63,113.83 ; 87.63,119.64 87.63,121.75 89.46,123.57 90.06,123.57 ; 134.74,44.98 134.82,45.06 LED268.1 ; 134.74,44.98 134.74,43.22 ; 134.74,44.98 134.74,50.98 ; 87.63,90.34 87.58,90.39 LED162.1 ; 87.63,90.34 87.63,84.19 ; 87.63,90.34 87.63,99.95 ; 56.23,11.84 56.23,13.67 ; 56.23,11.84 56.23,5.57 ; 56.23,11.84 56.19,11.88 LED88.1 ; 56.23,13.67 56.23,19.7 ; 56.23,13.67 56.24,13.66 LED117.1 ; 103.33,90.3 103.33,92.16 ; 103.33,90.3 103.25,90.39 LED194.1 ; 103.33,92.16 103.33,98.08 ; 103.33,92.16 103.35,92.17 LED203.1 ; LED255.1 134.71,82.54 134.74,82.57 ; 134.74,107.68 134.74,111.65 132.59,113.8 LED259.1 ; 134.74,107.68 134.74,106.08 ; 134.74,107.68 134.93,107.87 LED260.1 ; 24.88,11.69 24.7,11.88 LED24.1 ; 24.88,11.69 24.88,13.69 ; 24.88,11.69 24.88,10.16 ; LED124.1 71.8,43.28 71.93,43.15 ; 24.88,27.54 24.88,21.51 ; 24.88,27.54 24.88,29.4 ; 24.88,27.54 24.85,27.58 LED26.1 ; 24.88,21.51 24.89,21.51 LED52.1 ; 24.88,21.51 24.88,19.67 ; 40.53,45.02 40.53,43.35 ; 40.53,45.02 40.56,45.06 LED81.1 ; 40.53,45.02 40.53,51.19 ; 40.53,43.35 40.53,37.17 ; 40.53,43.35 40.45,43.28 LED60.1 ; 9.12,60.69 9.12,66.7 ; 9.12,60.69 9.2,60.76 LED17.1 ; 9.12,60.69 9.12,58.78 ; 9.12,66.7 9.12,68.57 ; 9.12,66.7 8.99,66.83 LED4.1 ; LED59.1 40.45,35.43 40.53,35.36 ; LED75.1 40.62,92.17 40.53,92.26 ; 119.04,29.42 119.09,29.36 LED243.1 ; 119.04,29.42 119.04,27.59 ; 119.04,29.42 119.04,35.48 ; 22.67,19.73 24.83,19.73 24.88,19.67 ; 103.33,44.91 105.61,44.91 LED209.1 ; 103.33,44.91 103.33,43.1 ; 103.33,44.91 103.33,52.83 ; LED262.1 134.77,92.17 134.74,92.14 ; 134.74,82.57 134.74,84.3 ; 134.74,82.57 134.74,76.43 ; 134.74,84.3 134.74,90.33 ; 134.74,84.3 134.75,84.32 LED263.1 ; 119.04,11.74 118.9,11.88 LED216.1 ; 119.04,11.74 119.04,8.64 ; 119.04,11.74 119.04,13.71 ; 71.93,107.9 71.93,113.9 ; 71.93,107.9 71.96,107.87 74.36,107.87 ; 71.93,107.9 71.93,106.09 ; 71.93,113.9 71.93,115.63 ; 71.93,113.9 71.89,113.94 LED133.1 ; 134.74,60.74 134.76,60.76 LED266.1 ; 134.74,60.74 134.74,66.69 ; 36.13,1.78 LED55.1 39.84,4.02 40.53,4.71 ; 36.13,1.78 51.83,1.78 ; 36.13,1.78 27.11,1.78 24.89,4 24.89,5.47 25.23,5.8 ; 74.36,45.06 74.26,44.96 71.93,44.96 ; LED264.1 134.78,76.46 134.74,76.43 ; 103.33,82.37 103.33,76.42 ; 103.33,82.37 103.17,82.54 LED193.1 ; LED161.1 87.59,82.54 87.63,82.58 ; 87.63,19.78 87.63,13.62 ; 87.63,19.78 87.58,19.73 85.48,19.73 ; LED27.1 24.77,35.43 24.88,35.32 ; 119.04,8.64 129.35,8.64 LED246.1 134.05,11.88 134.74,12.56 134.74,27.52 ; 119.04,8.64 119.04,5.57 117.99,4.52 117.38,4.52 LED215.1 114.64,1.78 98.94,1.78 ; 87.63,74.6 87.63,76.34 ; 87.63,74.6 87.55,74.68 LED160.1 ; 87.63,74.6 87.63,68.53 ; 87.63,76.34 87.76,76.46 90.06,76.46 ; 87.63,76.34 87.63,82.58 ; 71.93,35.39 71.89,35.43 LED123.1 ; 71.93,35.39 71.93,29.3 ; 71.93,35.39 71.93,37.13 ; 56.23,98.41 56.23,99.95 ; 56.23,98.41 56.23,92.19 ; 56.23,98.41 56.06,98.24 LED99.1 ; 56.23,99.95 56.23,106.1 ; 56.23,99.95 56.3,100.02 LED106.1 ; 87.63,45.11 87.63,51.18 ; 87.63,45.11 87.63,43.3 ; 87.63,45.11 87.68,45.06 90.06,45.06 ; 87.63,51.18 87.58,51.13 LED157.1 ; 87.63,51.18 87.63,52.99 ; LED70.1 38.38,121.65 40.53,119.5 ; 9.12,52.91 11.55,52.91 LED18.1 ; 9.12,52.91 9.12,51.18 ; 9.12,52.91 9.12,58.78 ; 103.33,113.79 103.33,115.65 ; 103.33,113.79 103.19,113.94 LED197.1 ; 103.33,113.79 103.33,106.12 ; 103.33,115.65 105.69,115.65 LED200.1 ; 56.23,82.6 56.16,82.54 LED97.1 ; 56.23,82.6 56.23,84.25 ; 56.23,82.6 56.23,76.51 ; 134.74,98.18 134.68,98.24 LED257.1 ; 134.74,98.18 134.74,100.01 ; 134.74,98.18 134.74,92.14 ; LED43.1 25.08,92.17 24.88,91.97 ; 87.63,29.23 87.76,29.36 90.06,29.36 ; 87.63,29.23 87.63,27.54 ; 87.63,29.23 87.63,37.25 ; 40.53,68.57 40.57,68.61 LED78.1 ; 40.53,68.57 40.53,66.82 ; 9.12,51.18 9.08,51.13 LED2.1 ; 56.23,90.36 56.23,92.19 ; 56.23,90.36 56.2,90.39 LED98.1 ; 56.23,90.36 56.23,84.25 ; 56.23,92.19 56.25,92.17 LED107.1 ; 71.93,74.57 71.93,68.65 ; 71.93,74.57 71.82,74.68 LED128.1 ; 87.63,59.03 87.63,60.89 ; 87.63,59.03 87.63,52.99 ; 87.63,59.03 87.58,58.98 LED158.1 ; 87.63,60.89 87.63,66.77 ; 87.63,60.89 87.76,60.76 90.06,60.76 ; LED115.1 56.26,29.36 56.23,29.33 ; 40.53,4.71 40.53,11.81 ; 40.53,4.71 40.96,5.14 40.96,5.8 LED86.1 ; LED205.1 103.38,76.46 103.33,76.42 ; LED118.1 56.46,5.8 56.23,5.57 ; LED269.1 134.87,37.21 134.74,37.08 ; 40.53,27.6 40.53,21.65 ; 40.53,27.6 40.51,27.58 LED58.1 ; 40.53,27.6 40.53,29.39 ; 40.53,21.65 40.53,19.68 ; 40.53,21.65 40.67,21.51 LED84.1 ; 40.53,51.19 40.46,51.13 LED61.1 ; 40.53,51.19 40.53,53.02 ; LED261.1 134.74,100.02 134.74,100.01 ; 71.93,90.5 71.93,92.09 ; 71.93,90.5 71.93,84.24 ; 71.93,90.5 71.82,90.39 LED130.1 ; 71.93,92.09 72,92.17 74.36,92.17 ; 71.93,92.09 71.93,98.21 ; LED227.1 118.87,98.24 ; LED39.1 26.24,123.57 24.12,121.45 24.12,120.35 ; LED223.1 119,66.83 119.04,66.87 ; 119.04,19.67 119.04,21.42 ; 119.04,19.67 119.04,13.71 ; 119.04,21.42 119.04,27.59 ; 119.04,21.42 119.13,21.51 LED244.1 ; 87.63,113.83 87.52,113.94 LED165.1 ; 9.12,92.09 9.12,98.26 ; 9.12,92.09 9.2,92.17 LED13.1 ; 9.12,98.26 9.1,98.24 LED8.1 ; 9.12,98.26 9.12,99.93 ; 56.23,19.7 56.2,19.73 54.08,19.73 ; 56.23,19.7 56.23,21.51 ; 103.33,35.24 103.33,37.12 ; 103.33,35.24 103.15,35.43 LED187.1 ; 103.33,35.24 103.33,27.57 ; 103.33,37.12 105.68,37.12 LED210.1 ; 103.33,37.12 103.33,43.1 ; 40.53,119.5 40.53,121.15 41.39,122.01 41.39,122.62 42.35,123.57 LED71.1 ; 40.53,119.5 40.53,115.69 ; 87.63,13.62 87.67,13.66 90.06,13.66 ; 87.63,13.62 87.63,11.81 ; 72.14,76.45 74.35,76.45 74.36,76.46 ; LED231.1 120.52,123.57 119.04,122.08 119.04,119.5 ; 132.59,19.73 134.62,19.73 ; 24.88,52.89 24.88,51.05 ; 24.88,52.89 24.88,58.93 ; 24.88,52.89 24.91,52.91 LED48.1 ; 24.88,51.05 24.88,45 ; 24.88,51.05 24.8,51.13 LED29.1 ; 90.06,68.61 87.71,68.61 87.63,68.53 ; 98.94,1.78 98.94,2.01 100.95,4.02 LED183.1 101.79,4.02 103.33,5.57 103.33,11.89 ; 98.94,1.78 83.24,1.78 ; 74.36,60.76 74.29,60.7 71.93,60.7 ; 134.74,68.57 134.74,74.52 ; 134.74,68.57 134.74,66.69 ; 134.74,68.57 137.12,68.57 LED265.1 ; 134.74,74.52 134.74,76.43 ; 134.74,74.52 134.58,74.68 LED254.1 ; 90.06,100.02 89.99,99.95 87.63,99.95 ; 103.33,98.08 103.33,106.12 ; 103.33,98.08 103.18,98.24 LED195.1 ; 24.88,37.26 24.88,35.32 ; 24.88,37.26 24.93,37.21 LED50.1 ; 24.88,37.26 24.88,43.21 ; 24.88,35.32 24.88,29.4 ; 56.23,66.88 56.19,66.83 LED95.1 ; 56.23,66.88 56.23,60.78 ; 56.23,66.88 56.23,68.56 ; 56.23,45.14 56.3,45.06 LED113.1 ; 56.23,45.14 56.23,43.29 ; 56.23,45.14 56.23,51.15 ; 119.04,90.35 119,90.39 LED226.1 ; 119.04,90.35 119.04,92.18 ; 119.04,90.35 119.04,84.23 ; 83.24,1.78 LED151.1 86.58,4.02 87.63,5.08 87.63,5.8 90.06,5.8 ; 83.24,1.78 67.87,1.78 67.7,1.95 ; LED79.1 40.53,60.76 ; 40.53,60.76 40.53,58.89 ; 40.53,60.76 40.53,66.82 ; 134.74,66.69 134.6,66.83 LED253.1 ; 56.23,29.33 56.23,35.47 ; 56.23,29.33 56.23,27.62 ; 56.23,35.47 56.19,35.43 LED91.1 ; 56.23,35.47 56.23,37.25 ; 119.04,37.14 119.1,37.21 LED242.1 ; 119.04,37.14 119.04,35.48 ; 24.88,19.67 24.88,13.69 ; LED207.1 103.38,60.76 103.33,60.81 ; 71.93,29.3 71.93,27.59 ; 71.93,29.3 74.3,29.3 74.36,29.36 ; 71.93,44.96 71.93,43.15 ; 71.93,44.96 71.93,51.25 ; 24.88,29.4 24.92,29.36 LED51.1 ; LED1.1 8.99,43.28 9.12,43.42 ; 24.88,106.03 24.88,100 ; 24.88,106.03 24.88,107.86 ; 24.88,106.03 24.82,106.09 LED36.1 ; 24.88,100 24.9,100.02 LED42.1 ; 24.88,100 24.88,98.21 ; 56.23,60.78 56.25,60.76 LED111.1 ; LED92.1 56.21,43.28 56.23,43.29 ; LED201.1 103.63,107.87 ; LED3.1 8.92,58.98 9.12,58.78 ; 24.88,74.58 24.88,68.47 ; 24.88,74.58 24.88,76.26 ; 24.88,74.58 24.78,74.68 LED32.1 ; 24.88,68.47 24.88,66.61 ; 24.88,68.47 25.02,68.61 LED46.1 ; 71.93,19.73 71.93,21.54 ; 71.93,19.73 71.93,19.73 69.78,19.73 ; 71.93,19.73 71.93,13.64 ; 71.93,21.54 71.96,21.51 74.36,21.51 ; 71.93,21.54 71.93,27.59 ; 103.33,19.72 103.33,27.57 ; 103.33,19.72 103.33,11.89 ; LED63.1 40.52,66.83 40.53,66.82 ; LED256.1 134.68,90.39 134.74,90.33 ; 56.23,106.1 56.23,107.8 ; 56.23,106.1 56.22,106.09 LED100.1 ; 9.12,43.42 9.12,37.1 ; 9.14,16.06 9.14,11.9 12.15,8.89 23.61,8.89 24.88,10.16 ; 9.14,16.06 LED23.1 ; 9.14,16.06 9.12,16.08 9.12,21.55 ; 74.36,115.72 72.02,115.72 71.93,115.63 ; 119.04,60.68 119.04,66.87 ; 119.04,60.68 119.04,59.01 ; 119.04,60.68 119.12,60.76 LED239.1 ; 119.04,66.87 119.04,68.61 ; LED47.1 24.94,60.76 24.88,60.82 ; LED15.1 11.48,76.4 9.12,76.4 ; LED219.1 118.99,35.43 119.04,35.48 ; 40.53,19.68 40.48,19.73 38.38,19.73 ; 40.53,19.68 40.53,13.73 ; LED132.1 71.93,106.09 ; 71.93,106.09 71.93,100.02 ; LED230.1 116.89,121.65 119.04,119.5 ; 119.04,107.85 119.05,107.87 LED233.1 ; 119.04,107.85 119.04,113.9 ; 119.04,107.85 119.04,105.92 ; 56.23,107.8 56.23,113.96 ; 56.23,107.8 56.3,107.87 LED105.1 ; LED28.1 24.81,43.28 24.88,43.21 ; 9.25,107.98 9.36,107.87 LED11.1 ; 9.25,107.98 9.25,103.93 9.12,103.8 ; 9.25,107.98 9.25,114.02 10.45,115.23 11.05,115.23 LED10.1 ; 24.88,10.16 24.88,5.8 25.23,5.8 ; 56.23,21.51 56.23,27.62 ; 56.23,21.51 LED116.1 ; 56.23,27.62 56.19,27.58 LED90.1 ; 24.88,115.73 24.88,113.81 ; 24.88,115.73 24.88,119.58 24.12,120.35 ; 24.88,115.73 24.89,115.72 LED40.1 ; 24.88,113.81 24.75,113.94 LED37.1 ; 24.88,113.81 24.88,107.86 ; 134.74,43.22 134.74,37.08 ; 134.74,43.22 134.68,43.28 LED250.1 ; 87.63,43.3 87.63,37.25 ; 87.63,43.3 87.61,43.28 LED156.1 ; 103.63,13.72 103.69,13.66 LED213.1 ; 71.93,11.8 71.93,13.64 ; 71.93,11.8 71.86,11.88 LED120.1 ; 71.93,11.8 71.93,5.88 72,5.8 72.91,5.8 ; 71.93,13.64 71.95,13.66 74.36,13.66 ; 119.04,100.11 119.04,105.92 ; 119.04,100.11 119.04,92.18 ; 119.04,105.92 118.87,106.09 LED228.1 ; 71.93,68.65 71.96,68.61 74.36,68.61 ; 71.93,68.65 71.93,66.93 ; 24.88,60.82 24.88,58.93 ; 24.88,60.82 24.88,66.61 ; 24.88,13.69 24.92,13.66 LED53.1 ; LED131.1 71.9,98.24 71.93,98.21 ; 119.04,13.71 119.09,13.66 LED245.1 ; LED5.1 9.12,74.68 9.12,74.68 ; 87.63,66.77 87.63,68.53 ; 87.63,66.77 87.57,66.83 LED159.1 ; 90.06,52.91 87.71,52.91 87.63,52.99 ; 134.74,90.33 134.74,92.14 ; LED7.1 7.15,90.39 8.89,88.65 ; 56.23,76.51 56.27,76.46 LED109.1 ; 56.23,76.51 56.23,74.75 ; 103.33,11.89 103.32,11.88 LED184.1 ; 103.33,58.81 103.33,60.81 ; 103.33,58.81 103.33,52.83 ; 103.33,58.81 103.16,58.98 LED190.1 ; 103.33,60.81 103.33,66.83 ; 119.04,74.66 119.04,76.43 ; 119.04,74.66 119.04,68.61 ; 119.04,74.66 119.01,74.68 LED224.1 ; 119.04,76.43 119.04,82.53 ; 119.04,76.43 119.07,76.46 LED237.1 ; 90.06,115.72 87.88,115.72 ; LED22.1 9.17,21.51 9.12,21.55 ; 71.93,27.59 71.92,27.58 LED122.1 ; 40.53,58.89 40.53,53.02 ; 40.53,58.89 40.43,58.98 LED62.1 ; 134.74,106.08 134.73,106.09 LED258.1 ; 134.74,106.08 134.74,100.01 ; 56.23,37.25 56.27,37.21 LED114.1 ; 56.23,37.25 56.23,43.29 ; LED103.1 58.05,123.57 56.13,121.66 56.13,119.79 56.03,119.69 ; 9.12,68.57 9.12,74.68 ; 9.12,68.57 9.16,68.61 LED16.1 ; 9.12,74.68 9.12,76.4 ; 71.93,52.82 74.26,52.82 74.36,52.91 ; 71.93,52.82 71.93,60.7 ; 71.93,52.82 71.93,51.25 ; 134.74,50.98 134.59,51.13 LED251.1 ; 40.53,76.46 40.53,84.34 ; 40.53,76.46 40.53,76.46 LED77.1 ; 87.63,27.54 87.6,27.58 LED154.1 ; 71.93,60.7 71.93,66.93 ; 56.03,119.69 56.23,119.5 56.23,115.73 ; 56.03,119.69 54.08,121.65 LED102.1 ; 25.23,5.8 LED54.1 ; LED236.1 119.13,84.32 119.04,84.23 ; 71.93,98.21 71.93,100.02 ; 24.88,76.26 25.08,76.46 LED45.1 ; 24.88,76.26 24.88,82.28 ; 24.88,98.21 24.85,98.24 LED35.1 ; 24.88,98.21 24.88,91.97 ; 56.23,51.15 56.21,51.13 LED93.1 ; 56.23,51.15 56.23,52.85 ; 9.12,37.1 9.12,35.5 9.1,35.48 ; 9.12,37.1 9.23,37.21 LED20.1 ; 24.88,91.97 24.88,90.35 ; LED222.1 119.01,58.98 119.04,59.01 ; H1.1 6.6,27.67 D1.1 6.59,29.54 C1.2 8.92,29.72 9.1,29.54 ; 56.23,113.96 56.21,113.94 LED101.1 ; 56.23,113.96 56.23,115.73 ; LED72.1 40.55,115.72 40.53,115.69 ; LED232.1 119.06,115.72 119.04,115.69 ; LED248.1 134.68,27.58 134.74,27.52 ; 40.53,99.97 42.91,99.97 LED74.1 ; 40.53,99.97 40.53,92.26 ; 24.88,82.28 24.62,82.54 LED33.1 ; 24.88,82.28 24.88,84.28 ; 71.93,37.13 72.01,37.21 74.36,37.21 ; 71.93,37.13 71.93,43.15 ; 56.23,52.85 56.29,52.91 LED112.1 ; 71.93,84.24 72.01,84.32 74.36,84.32 ; 119.04,84.23 119.04,82.53 ; LED126.1 71.63,58.98 ; LED85.1 40.6,13.66 40.53,13.73 ; LED191.1 103.33,66.83 103.33,66.83 ; 24.88,90.35 24.88,84.28 ; 24.88,90.35 24.85,90.39 LED34.1 ; 24.88,84.28 24.92,84.32 LED44.1 ; 119.04,27.59 119.02,27.58 LED218.1 ; LED225.1 119.03,82.54 119.04,82.53 ; 9.1,29.54 9.1,29.31 9.12,29.29 ; 9.1,29.54 9.1,35.48 ; 134.74,37.08 134.74,35.25 ; 40.53,37.17 40.53,35.36 ; 40.53,37.17 40.57,37.21 LED82.1 ; 103.33,27.57 103.32,27.58 LED186.1 ; 119.04,68.61 119.04,68.61 LED238.1 ; 24.88,45 27.19,45 LED49.1 ; 24.88,45 24.88,43.21 ; 87.63,37.25 87.68,37.21 90.06,37.21 ; 40.53,11.81 40.46,11.88 LED56.1 ; 40.53,11.81 40.53,13.73 ; 67.7,1.95 LED119.1 71.13,4.02 72.91,5.8 ; 67.7,1.95 67.53,1.78 51.83,1.78 ; 119.04,59.01 119.04,51.17 ; 71.93,100.02 74.36,100.02 ; 40.53,90.34 40.48,90.39 LED66.1 ; 40.53,90.34 40.53,84.34 ; 40.53,90.34 40.53,92.26 ; 72.91,5.8 74.36,5.8 ; 103.33,52.83 105.68,52.83 LED208.1 ; LED163.1 87.63,98.24 ; LED241.1 119.1,45.06 119.04,45 ; 9.1,35.48 9.05,35.43 LED0.1 ; LED125.1 71.81,51.13 71.93,51.25 ; LED31.1 24.66,66.83 24.88,66.61 ; 87.63,11.81 87.57,11.88 LED152.1 ; 87.63,11.81 87.63,5.91 ; 71.93,66.93 71.83,66.83 LED127.1 ; 87.63,84.19 87.75,84.32 90.06,84.32 ; 87.63,84.19 87.63,82.58 ; 56.23,5.57 54.68,4.02 LED87.1 51.83,1.78 ; 119.04,113.9 119.04,115.69 ; 119.04,113.9 119,113.94 LED229.1 ; 119.04,92.18 119.05,92.17 LED235.1 ; LED155.1 87.38,35.43 ; LED104.1 56.24,115.72 56.23,115.73 ; 40.53,35.36 40.53,29.39 ; 40.53,29.39 40.56,29.36 LED83.1 ; 56.23,74.75 56.17,74.68 LED96.1 ; 56.23,74.75 56.23,68.56 ; 40.53,84.34 40.55,84.32 LED76.1 ; 103.33,76.42 103.33,74.69 ; 119.04,45 119.04,51.17 ; 119.04,51.17 119,51.13 LED221.1 ; LED80.1 40.63,52.91 40.53,53.02 ; 134.74,27.52 134.74,35.25 ; 71.93,115.63 71.93,119.64 ; 71.93,119.64 LED134.1 ; 71.93,119.64 71.93,122.48 73.03,123.57 74.36,123.57 ; 9.12,76.4 9.12,82.49 ; 9.12,82.49 9.07,82.54 LED6.1 ; 9.12,99.93 9.21,100.02 LED12.1 ; 9.12,99.93 9.12,103.8 ; 134.74,35.25 134.56,35.43 LED249.1 ; 9.12,21.55 9.12,29.29 ; LED214.1 103.63,5.8 ; 9.12,29.29 9.19,29.36 LED21.1 ; 24.12,120.35 LED38.1 ; LED9.1 8.94,104.12 8.94,103.98 9.12,103.8 ; LED202.1 103.63,100.02 ; 56.23,68.56 56.28,68.61 LED110.1 ; 119.04,115.69 119.04,119.5 ; 103.33,106.12 103.31,106.09 LED196.1 ; 103.33,43.1 103.15,43.28 LED188.1 ; 24.88,107.86 24.89,107.87 LED41.1 ; 24.88,58.93 24.83,58.98 LED30.1 ; LED212.1 103.63,21.51 ; LED189.1 103.12,51.13 ; 103.33,74.68 LED192.1 ; LED240.1 119.38,52.91 ; LED65.1 40.52,82.54 ; LED67.1 40.39,98.24 ; 90.06,92.17 87.63,92.17
DIN: length 12
  Top Layer w0.254: H1.2 1.78,27.94 1.78,32 3.3,33.53 C2.2 3.87,35.25 LED0.4
$1N32473: length 10.4
  Top Layer w0.254: LED11.4 14.82,109.61 arc(14.82,109.62) 14.82,109.63 15.19,109.63 arc(16.09,110) 16.46,110.91 arc(16.09,111.81) 15.19,112.19 14.24,112.19 arc(13.37,112.36) 12.63,112.85 LED10.2
$1N32479: length 10.4
  Top Layer w0.254: LED11.2 12.63,105.01 arc(13.37,104.51) 14.24,104.34 15.19,104.34 arc(16.09,103.96) 16.46,103.06 arc(16.09,102.16) 15.19,101.78 14.82,101.78 arc(14.82,101.77) 14.82,101.76 LED12.4
$1N32486: length 10.4
  Top Layer w0.254: LED12.2 12.63,97.16 arc(13.37,96.66) 14.24,96.49 15.19,96.49 arc(16.09,96.12) 16.46,95.21 arc(16.09,94.31) 15.19,93.93 14.82,93.93 arc(14.82,93.92) 14.82,93.91 LED13.4
$1N32492: length 10.4
  Top Layer w0.254: LED14.4 14.82,86.06 arc(14.82,86.07) 14.82,86.08 15.19,86.08 arc(16.09,86.46) 16.46,87.36 arc(16.09,88.27) 15.19,88.64 14.24,88.64 arc(13.36,88.82) 12.62,89.31 LED13.2
$1N32499: length 10.4
  Top Layer w0.254: LED14.2 12.62,81.46 arc(13.36,80.97) 14.24,80.79 15.19,80.79 arc(16.09,80.42) 16.46,79.51 arc(16.09,78.61) 15.19,78.24 14.82,78.24 arc(14.82,78.22) 14.82,78.21 LED15.4
$1N32506: length 10.4
  Top Layer w0.254: LED16.4 14.82,70.36 arc(14.82,70.37) 14.82,70.39 15.19,70.39 arc(16.09,70.76) 16.46,71.67 arc(16.09,72.57) 15.19,72.94 14.24,72.94 arc(13.36,73.12) 12.62,73.62 LED15.2
$1N32513: length 10.4
  Top Layer w0.254: LED16.2 12.61,65.77 arc(13.36,65.27) 14.23,65.1 15.19,65.1 arc(16.09,64.72) 16.46,63.82 arc(16.09,62.91) 15.19,62.54 14.82,62.54 arc(14.82,62.52) 14.82,62.51 LED17.4
$1N32523: length 10.4
  Top Layer w0.254: LED18.4 14.82,54.66 arc(14.82,54.67) 14.82,54.69 15.19,54.69 arc(16.09,55.06) 16.46,55.97 arc(16.09,56.87) 15.19,57.25 14.23,57.25 arc(13.36,57.42) 12.61,57.92 LED17.2
$1N32530: length 10.4
  Top Layer w0.254: LED19.4 14.82,46.8 arc(14.82,46.82) 14.82,46.84 15.19,46.84 arc(16.09,47.22) 16.46,48.12 arc(16.09,49.02) 15.19,49.4 14.23,49.4 arc(13.35,49.57) 12.61,50.07 LED18.2
$1N32537: length 10.4
  Top Layer w0.254: LED20.4 14.82,38.95 arc(14.82,38.97) 14.82,38.99 15.19,38.99 arc(16.09,39.37) 16.46,40.27 arc(16.09,41.18) 15.19,41.55 14.23,41.55 arc(13.35,41.73) 12.6,42.22 LED19.2
$1N32544: length 10.4
  Top Layer w0.254: LED20.2 12.53,34.45 arc(13.35,33.9) 14.33,33.7 15.19,33.7 arc(16.09,33.33) 16.46,32.42 arc(16.09,31.52) 15.19,31.14 14.82,31.14 arc(14.82,31.12) 14.82,31.1 LED21.4
$1N32551: length 10.4
  Top Layer w0.254: LED21.2 12.6,26.53 arc(13.35,26.03) 14.23,25.85 15.19,25.85 arc(16.09,25.48) 16.46,24.57 arc(16.09,23.67) 15.19,23.3 14.82,23.3 arc(14.82,23.27) 14.82,23.25 LED22.4
$1N32558: length 7.4
  Top Layer w0.254: 11.55,19.73 14.82,16.45 LED23.4
$1N32565: length 10.3
  Top Layer w0.254: LED1.4 3.7,41.73 arc(3.62,41.62) 3.52,41.55 3.33,41.55 arc(2.43,41.18) 2.06,40.27 arc(2.43,39.37) 3.33,38.99 4.14,38.99 arc(5.11,38.8) 5.93,38.25 LED0.2
$1N32571: length 10.3
  Top Layer w0.254: LED2.4 3.7,49.58 arc(3.62,49.47) 3.52,49.4 3.33,49.4 arc(2.43,49.02) 2.06,48.12 arc(2.43,47.22) 3.33,46.84 4.14,46.84 arc(5.11,46.65) 5.94,46.1 LED1.2
$1N32578: length 10.2
  Top Layer w0.254: LED2.2 5.85,54.03 arc(5.12,54.52) 4.26,54.69 3.33,54.69 arc(2.43,55.06) 2.06,55.97 arc(2.43,56.87) 3.33,57.25 arc(3.55,57.39) 3.7,57.61 LED3.4
$1N32584: length 10.2
  Top Layer w0.254: LED4.4 3.7,65.46 arc(3.55,65.24) 3.33,65.1 arc(2.43,64.72) 2.06,63.82 arc(2.43,62.91) 3.33,62.54 4.27,62.54 arc(5.12,62.37) 5.85,61.88 LED3.2
$1N32591: length 10.2
  Top Layer w0.254: LED4.2 5.86,69.73 arc(5.13,70.22) 4.27,70.39 3.33,70.39 arc(2.43,70.76) 2.06,71.67 arc(2.43,72.57) 3.33,72.94 arc(3.55,73.09) 3.7,73.31 LED5.4
$1N32601: length 10.2
  Top Layer w0.254: LED6.4 3.7,81.16 arc(3.55,80.94) 3.33,80.79 arc(2.43,80.42) 2.06,79.51 arc(2.43,78.61) 3.33,78.24 4.27,78.24 arc(5.13,78.06) 5.86,77.58 LED5.2
$1N32608: length 10.2
  Top Layer w0.254: LED7.4 3.61,90.3 3.61,88.95 3.33,88.68 3.33,88.64 arc(2.43,88.27) 2.06,87.36 arc(2.43,86.46) 3.33,86.08 4.15,86.08 arc(5.12,85.89) 5.95,85.34 LED6.2
$1N32615: length 10.4
  Top Layer w0.254: LED7.2 5.95,93.19 arc(5.13,93.74) 4.15,93.93 3.33,93.93 arc(2.43,94.31) 2.06,95.21 arc(2.43,96.12) 3.33,96.49 3.7,96.49 arc(3.7,96.49) 3.7,96.49 LED8.4
$1N32622: length 10.4
  Top Layer w0.254: LED8.2 5.95,101.04 arc(5.13,101.59) 4.16,101.78 3.33,101.78 arc(2.43,102.16) 2.06,103.06 arc(2.43,103.96) 3.33,104.34 3.7,104.34 arc(3.7,104.34) 3.7,104.35 LED9.4
$1N32635: length 8.9
  Top Layer w0.254: LED23.2 13.16,11.88 13.93,12.65 15.71,12.65 16.49,11.88 LED24.4 19.4,11.42
$1N32647: length 7.4
  Top Layer w0.254: 19.4,19.73 22.67,16.45 LED24.2
$1N32661: length 10.3
  Top Layer w0.254: LED26.4 19.4,26.03 arc(19.33,25.93) 19.22,25.85 19.04,25.85 arc(18.13,25.48) 17.76,24.57 arc(18.13,23.67) 19.04,23.3 19.83,23.3 arc(20.81,23.1) 21.63,22.55 LED25.2
$1N32665: length 10.3
  Top Layer w0.254: LED27.4 19.4,33.88 arc(19.33,33.77) 19.22,33.7 19.04,33.7 arc(18.13,33.33) 17.76,32.42 arc(18.13,31.52) 19.04,31.14 19.84,31.14 arc(20.81,30.95) 21.63,30.4 LED26.2
$1N32669: length 10.3
  Top Layer w0.254: LED27.2 21.63,38.25 arc(20.81,38.8) 19.84,38.99 19.04,38.99 arc(18.13,39.37) 17.76,40.27 arc(18.13,41.18) 19.04,41.55 19.22,41.55 arc(19.33,41.62) 19.4,41.73 LED28.4
$1N32679: length 10.3
  Top Layer w0.254: LED28.2 21.64,46.1 arc(20.81,46.65) 19.84,46.84 19.04,46.84 arc(18.13,47.22) 17.76,48.12 arc(18.13,49.02) 19.04,49.4 19.22,49.4 arc(19.33,49.47) 19.4,49.58 LED29.4
$1N32683: length 10.3
  Top Layer w0.254: LED29.2 21.64,53.95 arc(20.82,54.5) 19.84,54.69 19.04,54.69 arc(18.13,55.06) 17.76,55.97 arc(18.13,56.87) 19.04,57.25 19.22,57.25 arc(19.33,57.32) 19.4,57.43 LED30.4
$1N32687: length 10.3
  Top Layer w0.254: LED30.2 21.64,61.79 arc(20.82,62.35) 19.85,62.54 19.04,62.54 arc(18.13,62.91) 17.76,63.82 arc(18.13,64.72) 19.04,65.1 19.22,65.1 arc(19.33,65.17) 19.4,65.28 LED31.4
$1N32691: length 10.3
  Top Layer w0.254: LED31.2 21.64,69.64 arc(20.82,70.19) 19.85,70.39 19.04,70.39 arc(18.13,70.76) 17.76,71.67 arc(18.13,72.57) 19.04,72.94 19.22,72.94 arc(19.33,73.02) 19.4,73.13 LED32.4
$1N32695: length 10.3
  Top Layer w0.254: LED32.2 21.65,77.49 arc(20.82,78.04) 19.85,78.24 19.04,78.24 arc(18.13,78.61) 17.76,79.51 arc(18.13,80.42) 19.04,80.79 19.22,80.79 arc(19.33,80.87) 19.4,80.97 LED33.4
$1N32699: length 10.4
  Top Layer w0.254: LED33.2 21.65,85.34 arc(20.83,85.89) 19.85,86.08 19.04,86.08 arc(18.13,86.46) 17.76,87.36 arc(18.13,88.27) 19.04,88.64 19.4,88.64 ; LED34.4 19.4,88.64
$1N32703: length 10.4
  Top Layer w0.254: LED35.4 19.4,96.49 arc(19.4,96.49) 19.4,96.49 19.04,96.49 arc(18.13,96.12) 17.76,95.21 arc(18.13,94.31) 19.04,93.93 19.86,93.93 arc(20.83,93.74) 21.65,93.19 LED34.2
$1N32707: length 10.4
  Top Layer w0.254: LED35.2 21.66,101.04 arc(20.83,101.59) 19.86,101.78 19.04,101.78 arc(18.13,102.16) 17.76,103.06 arc(18.13,103.96) 19.04,104.34 19.4,104.34 arc(19.4,104.34) 19.4,104.35 LED36.4
$1N32711: length 10.4
  Top Layer w0.254: LED37.4 19.4,112.2 arc(19.4,112.19) 19.4,112.19 19.04,112.19 arc(18.13,111.81) 17.76,110.91 arc(18.13,110) 19.04,109.63 19.86,109.63 arc(20.83,109.44) 21.66,108.89 LED36.2
$1N32715: length 10.4
  Top Layer w0.254: LED38.4 19.4,120.05 arc(19.4,120.04) 19.4,120.04 19.04,120.04 arc(18.13,119.66) 17.76,118.76 arc(18.13,117.85) 19.04,117.48 19.86,117.48 arc(20.84,117.29) 21.66,116.73 LED37.2
$1N32731: length 10.4
  Top Layer w0.254: LED40.2 28.26,112.93 arc(29.08,112.38) 30.05,112.19 30.89,112.19 arc(31.79,111.81) 32.17,110.91 arc(31.79,110) 30.89,109.63 30.53,109.63 arc(30.52,109.62) 30.53,109.61 LED41.4
$1N32735: length 10.4
  Top Layer w0.254: LED42.4 30.53,101.76 arc(30.52,101.77) 30.53,101.78 30.89,101.78 arc(31.79,102.16) 32.17,103.06 arc(31.79,103.96) 30.89,104.34 30.05,104.34 arc(29.08,104.53) 28.26,105.08 LED41.2
$1N32739: length 10.4
  Top Layer w0.254: LED43.4 30.53,93.91 arc(30.52,93.92) 30.53,93.93 30.89,93.93 arc(31.79,94.31) 32.17,95.21 arc(31.79,96.12) 30.89,96.49 30.05,96.49 arc(29.08,96.68) 28.25,97.23 LED42.2
